# EasyEDA schematic 1-Schematic_8 Bit Computer - Through Hole.json

## Sheets
1 Clock Circuit: TITLE: Clock; REV: 1.0; Date: 2021-02-01; Sheet: 1/1; Drawn By: djh82uk
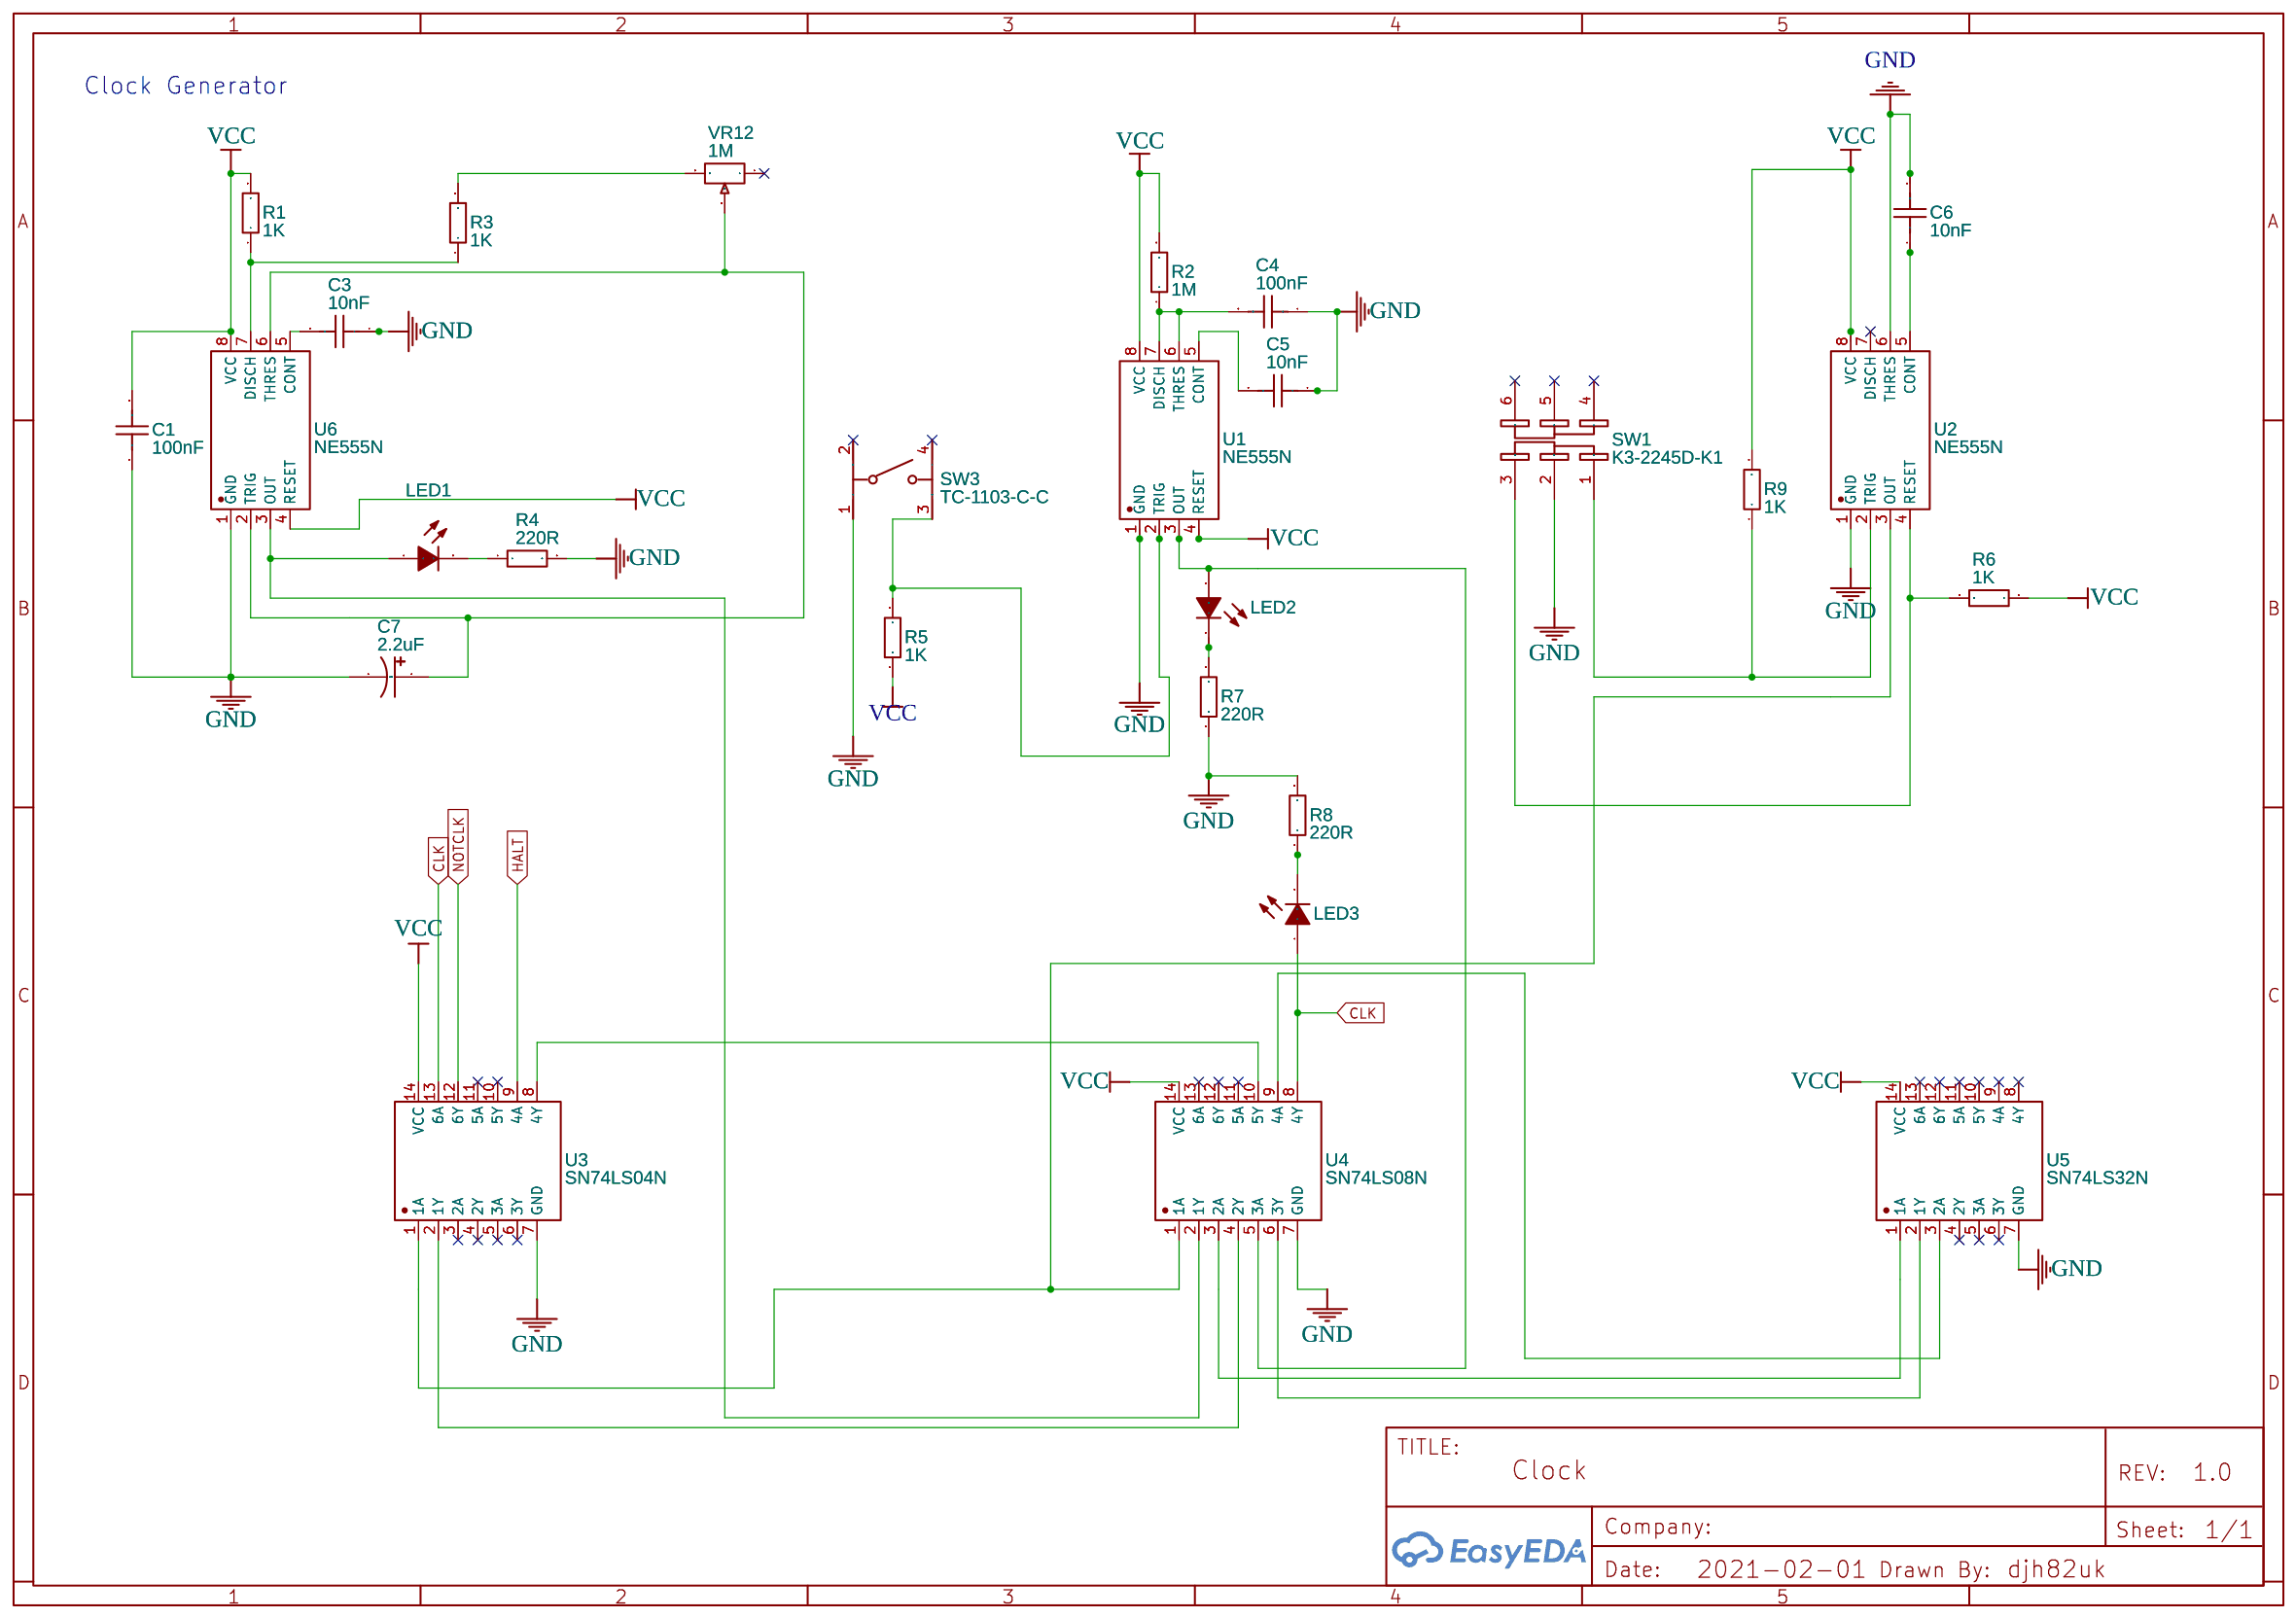
[diagram p0: Clock Circuit]
2 Program Counter: TITLE: Program Counter; Date: 2021-02-04
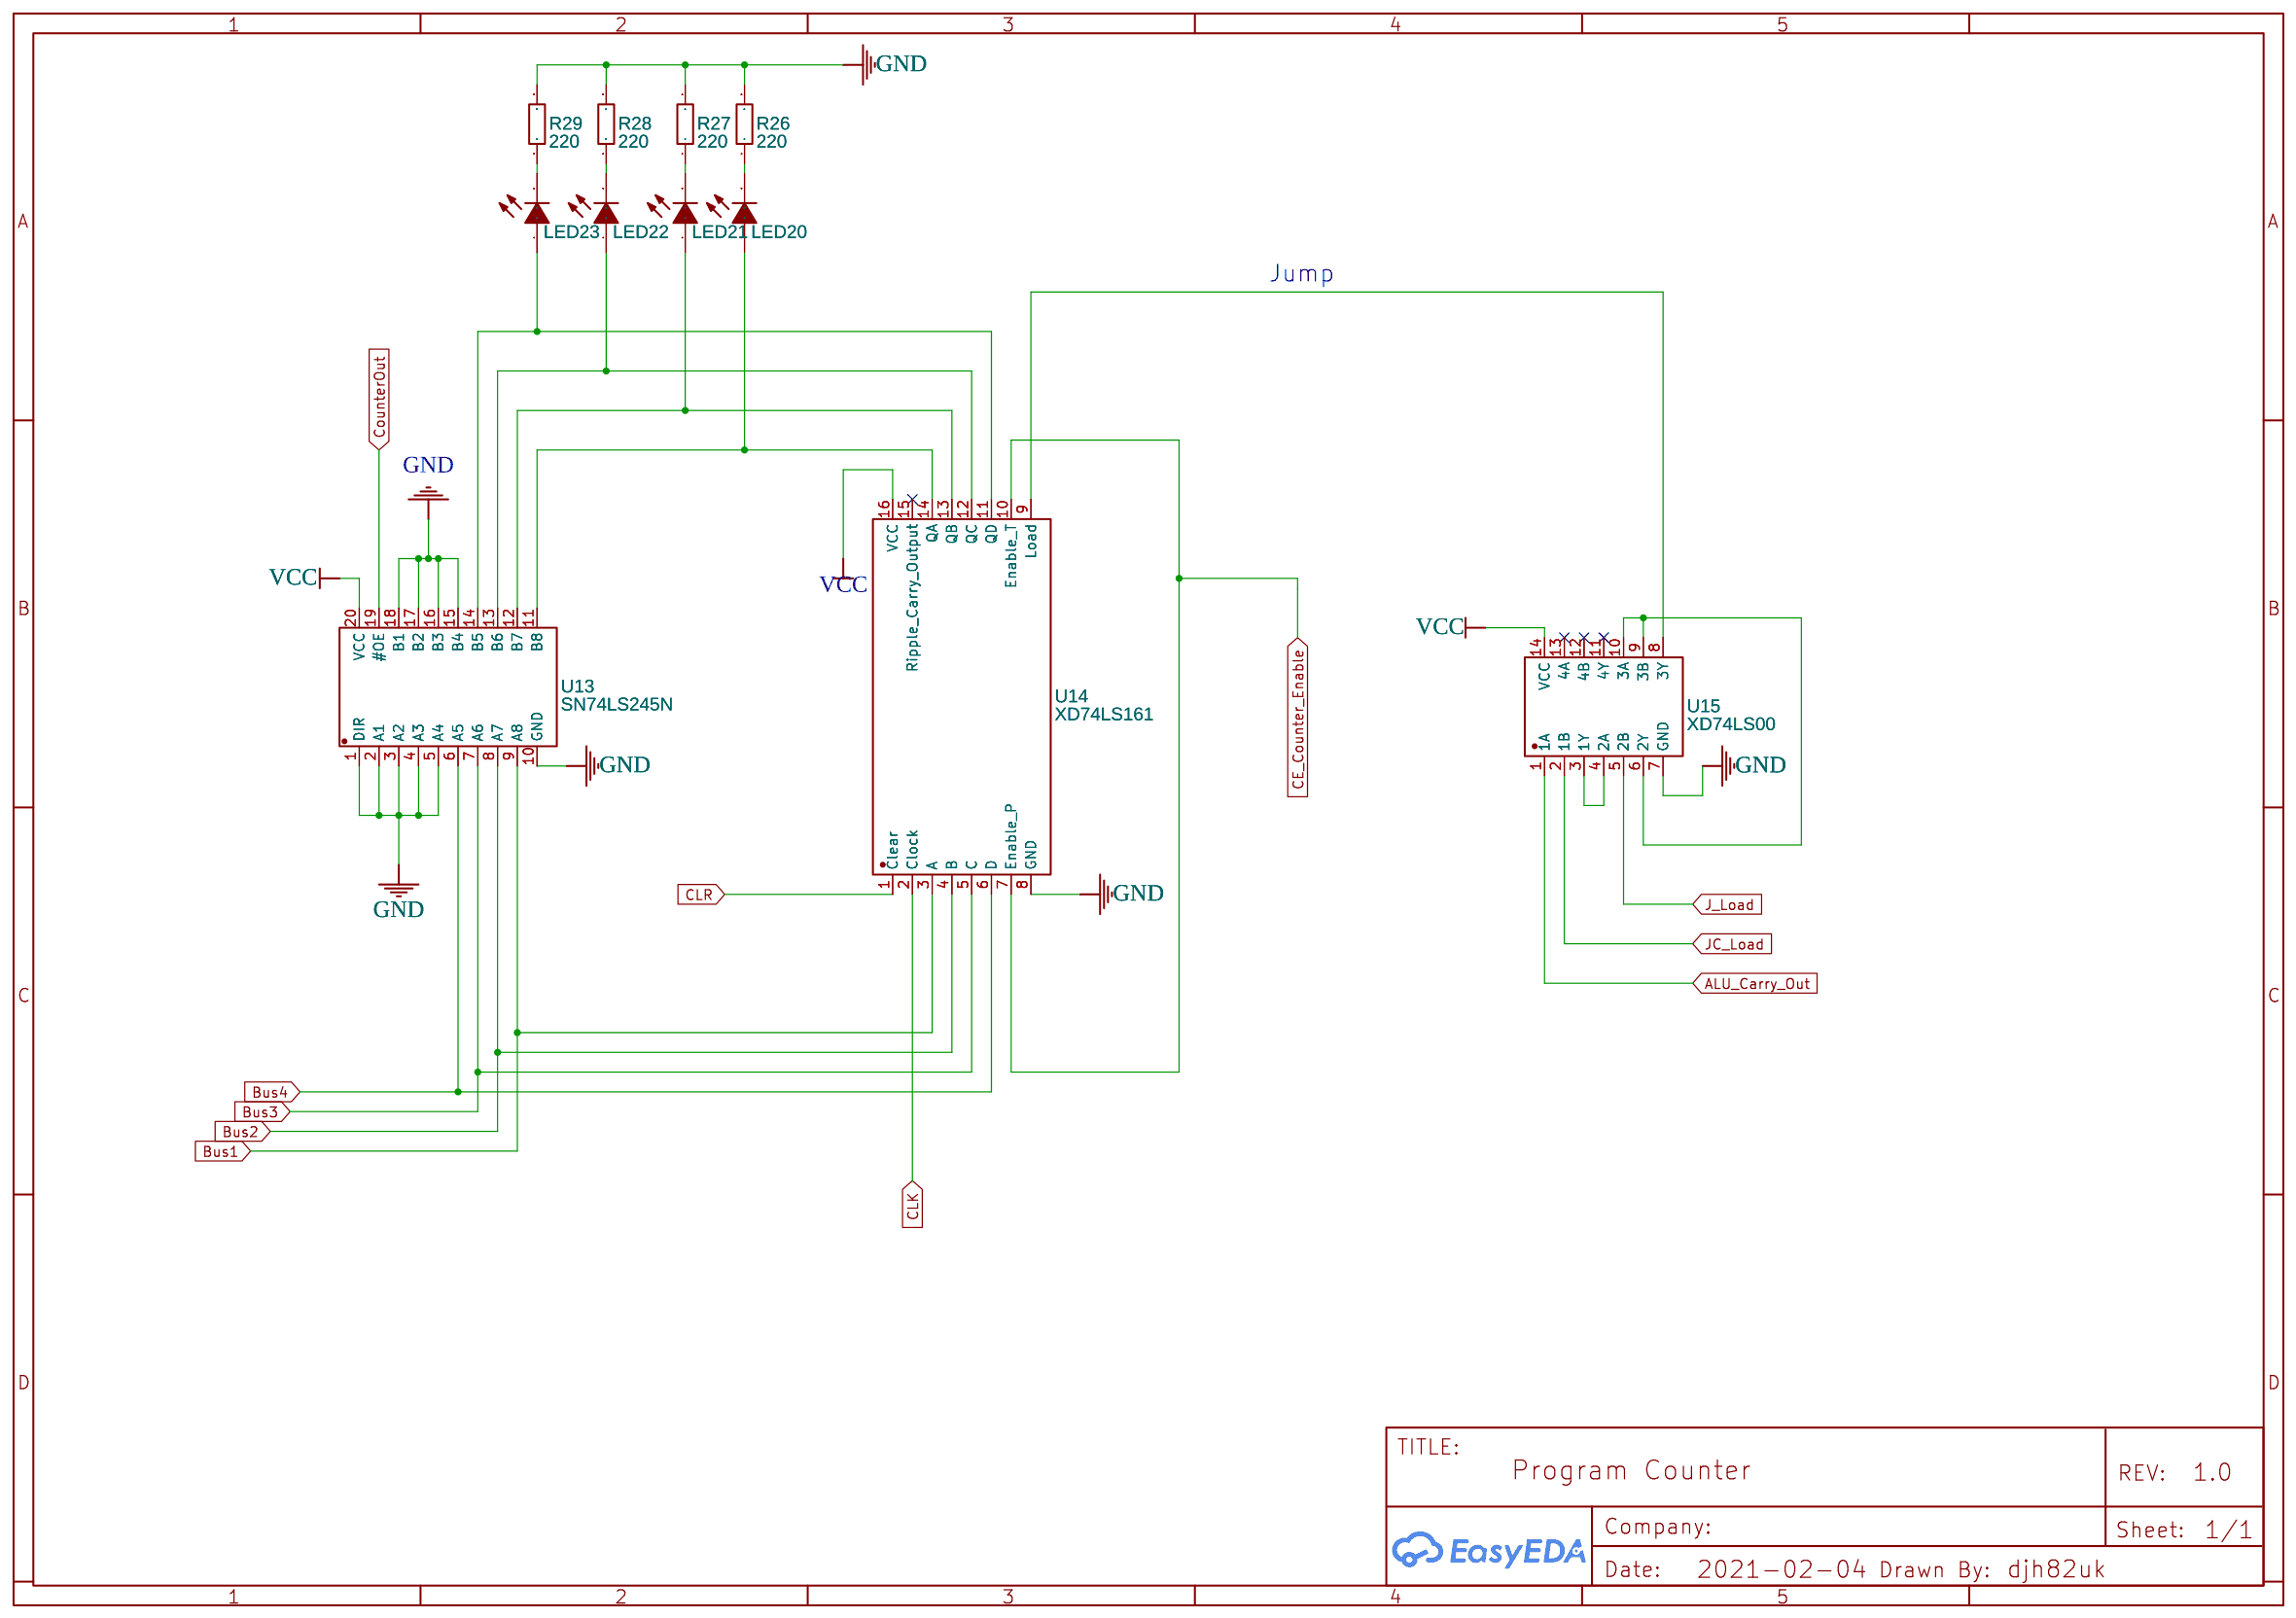
[diagram p1: Program Counter]
3 Register A: TITLE: Register A; Date: 2021-02-05; Company: Your Company
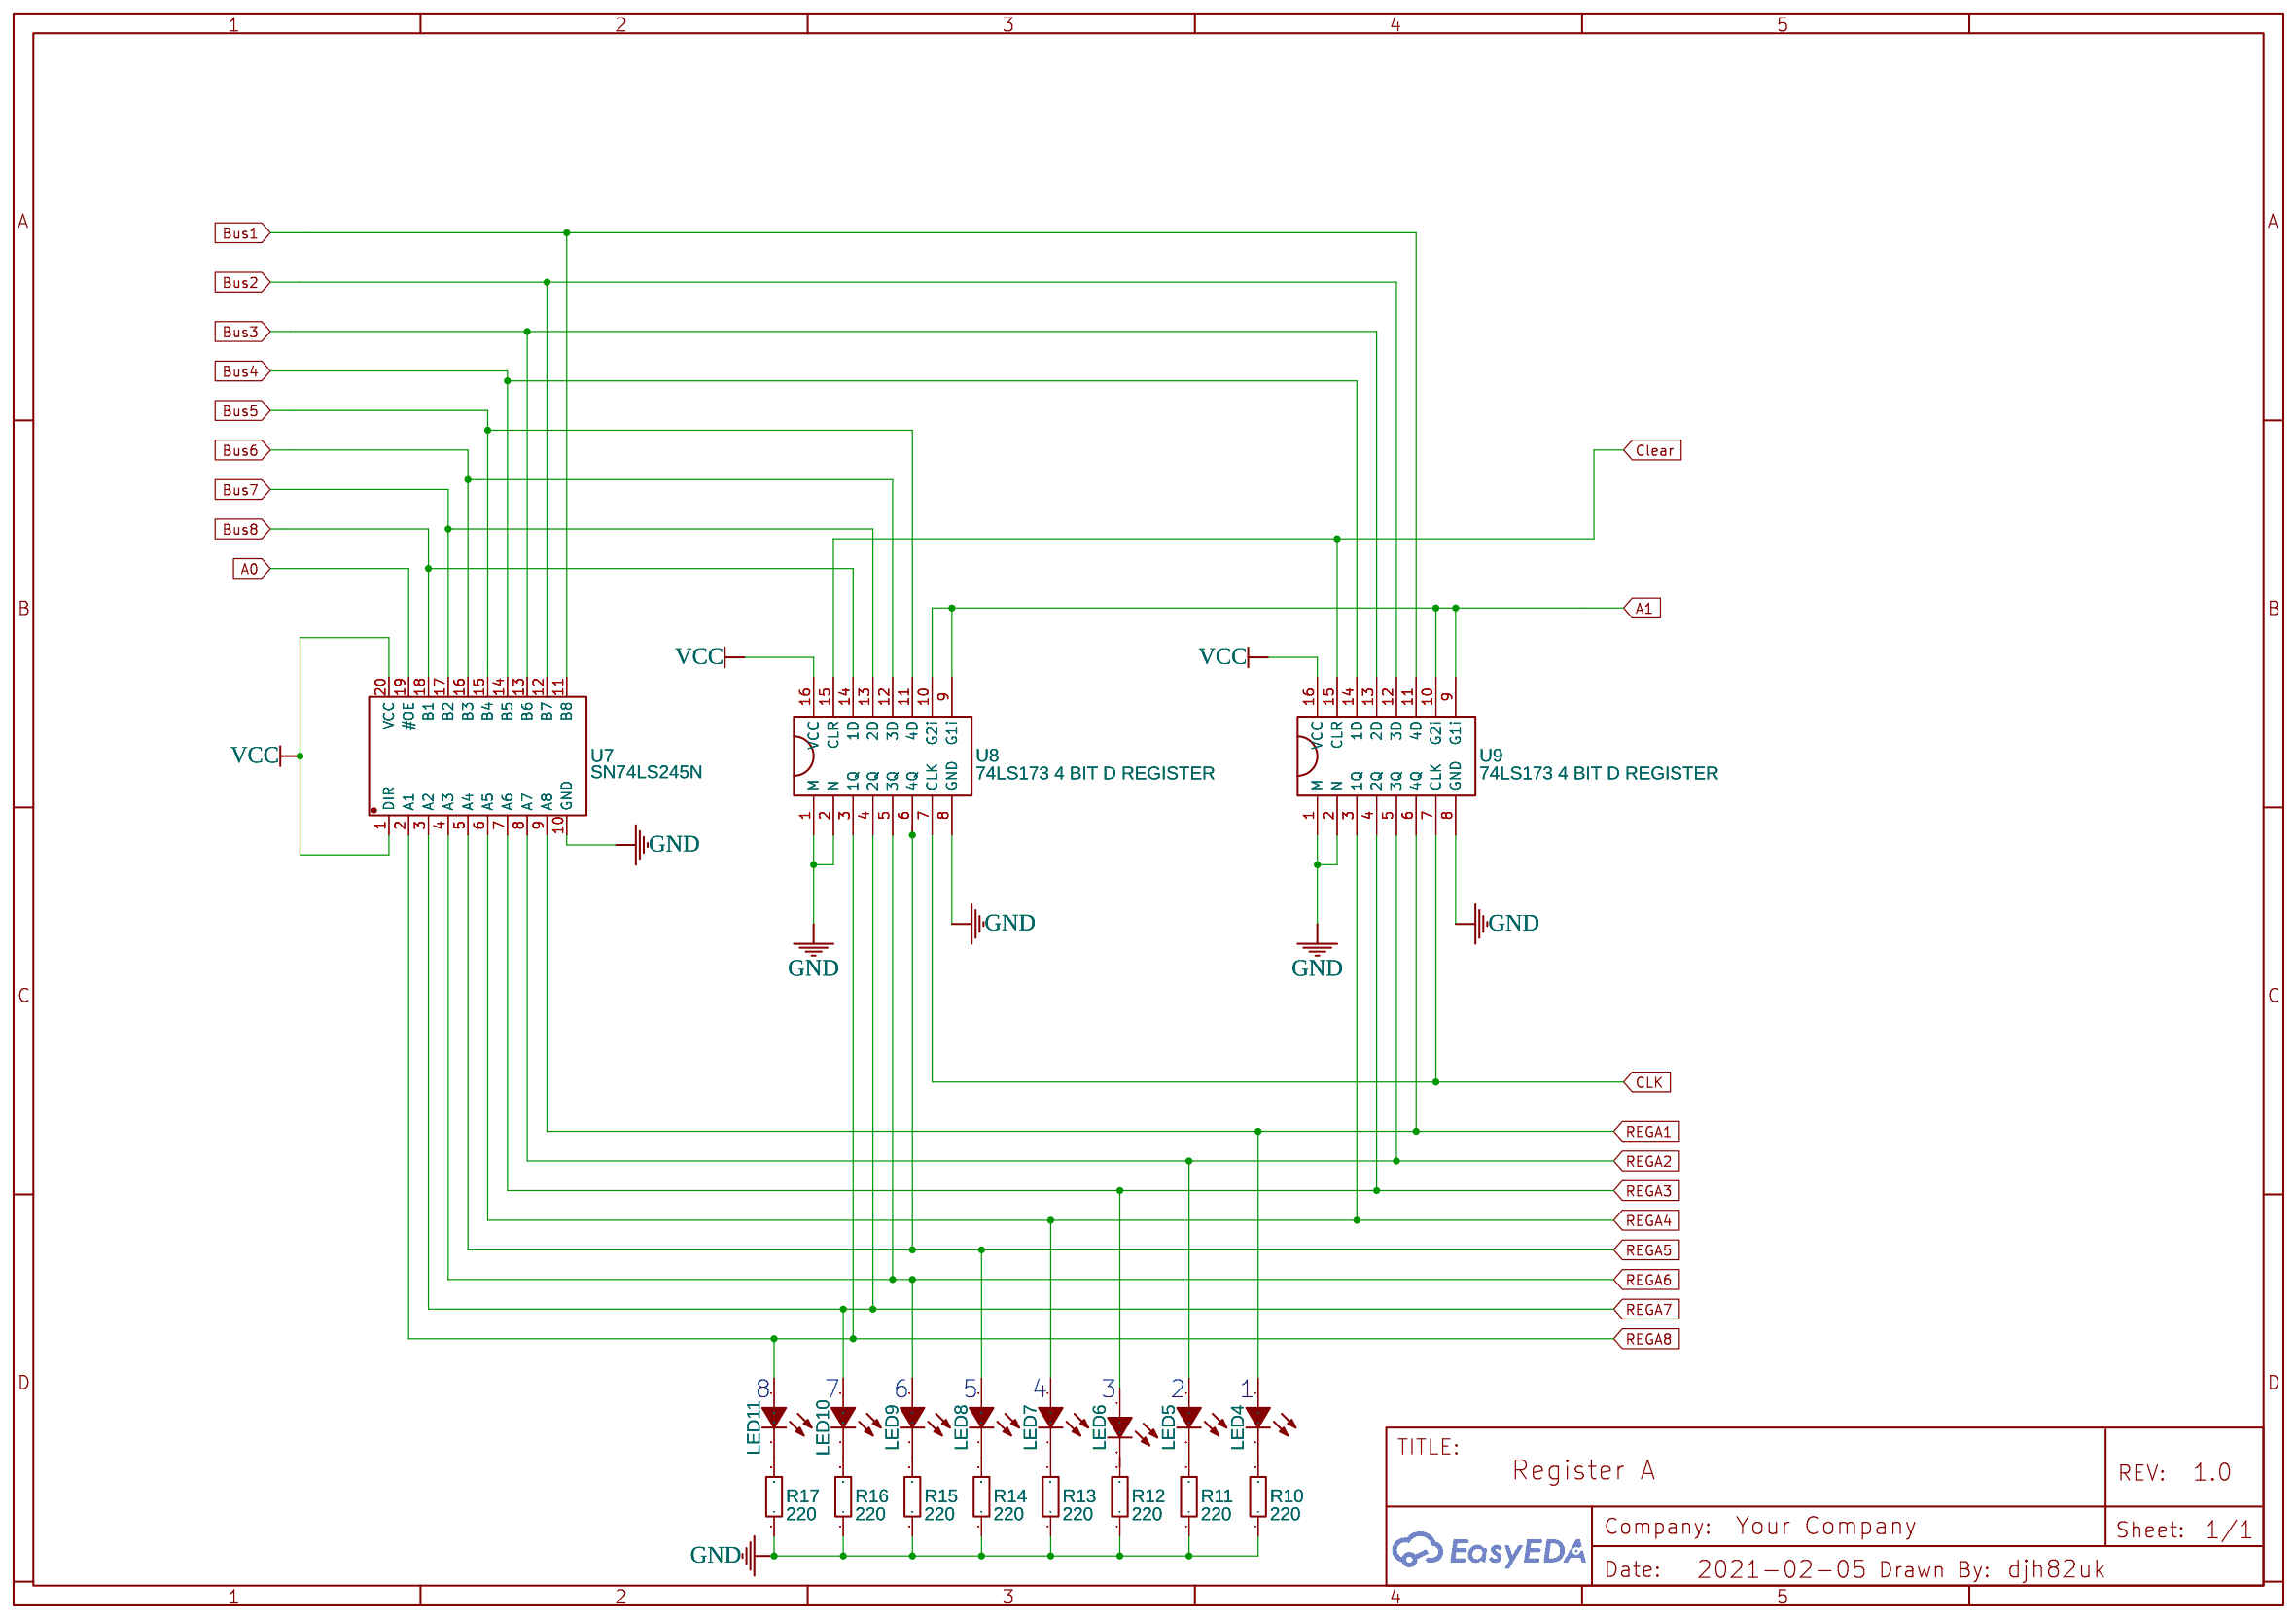
[diagram p2: Register A]
4 Register B: TITLE: Register B; Date: 2021-02-05; Company: Your Company
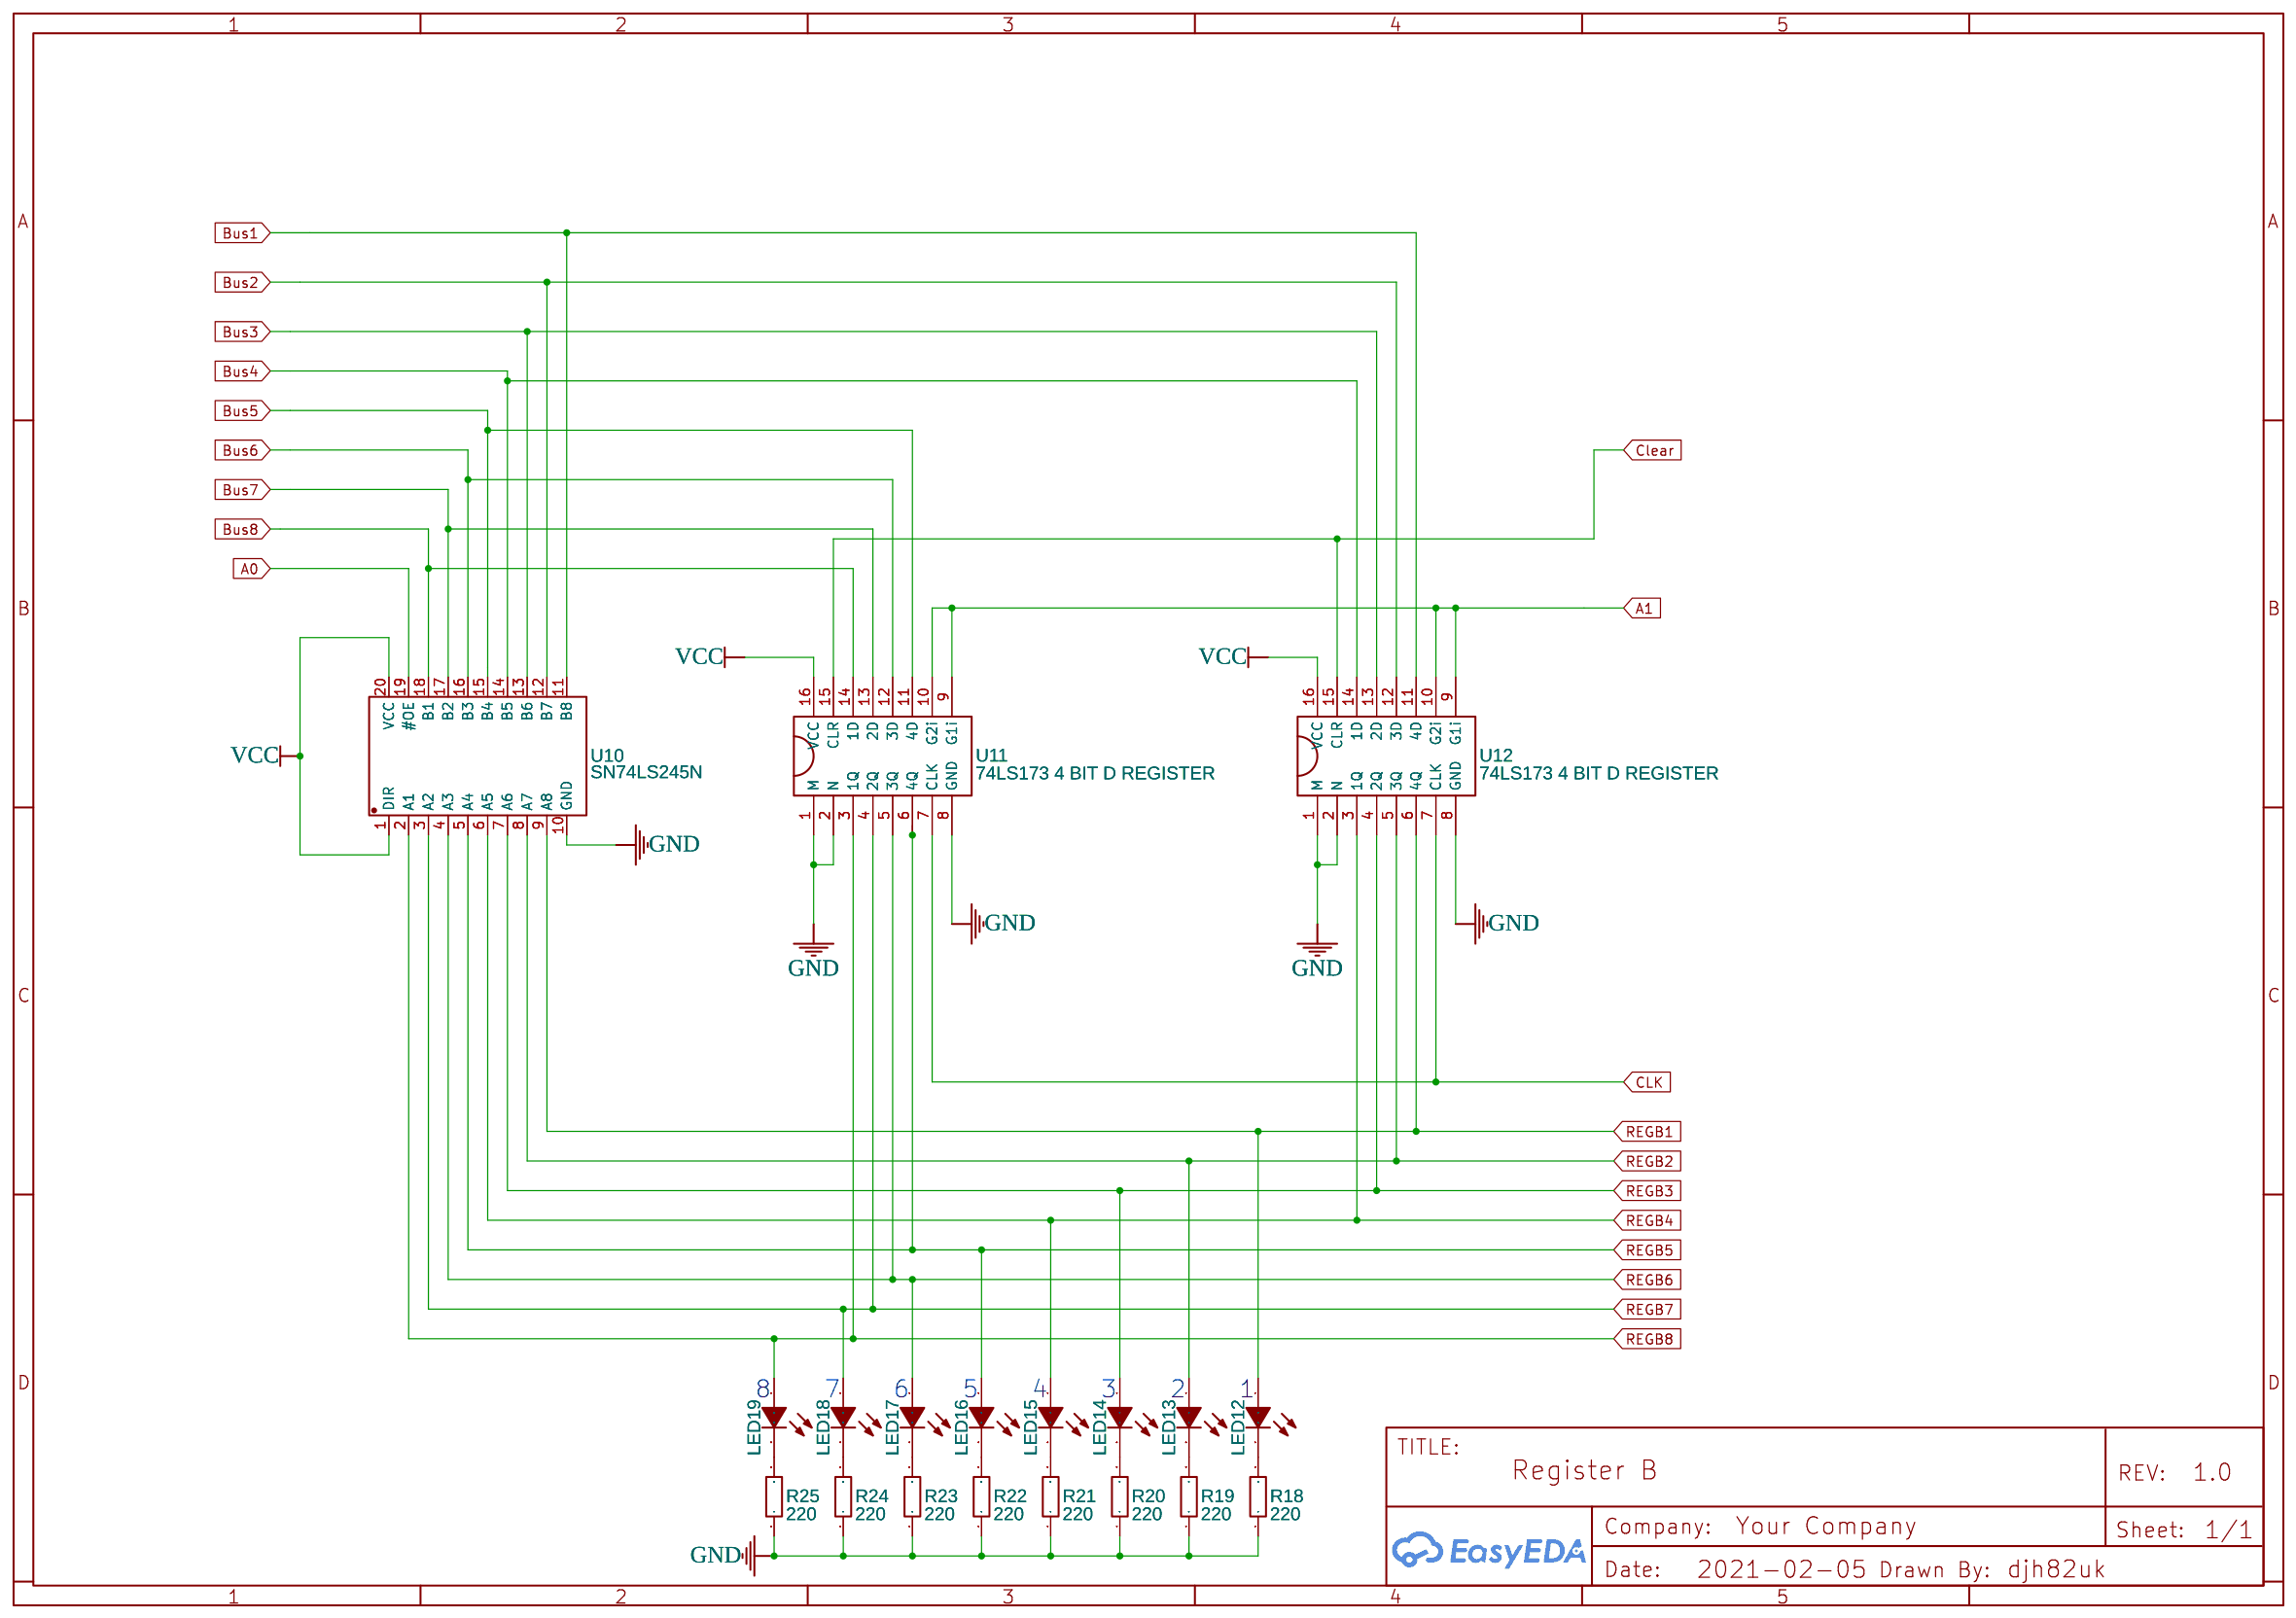
[diagram p3: Register B]
5 Instruction Register: TITLE: Instruction Register; Date: 2021-02-05; Company: Your Company
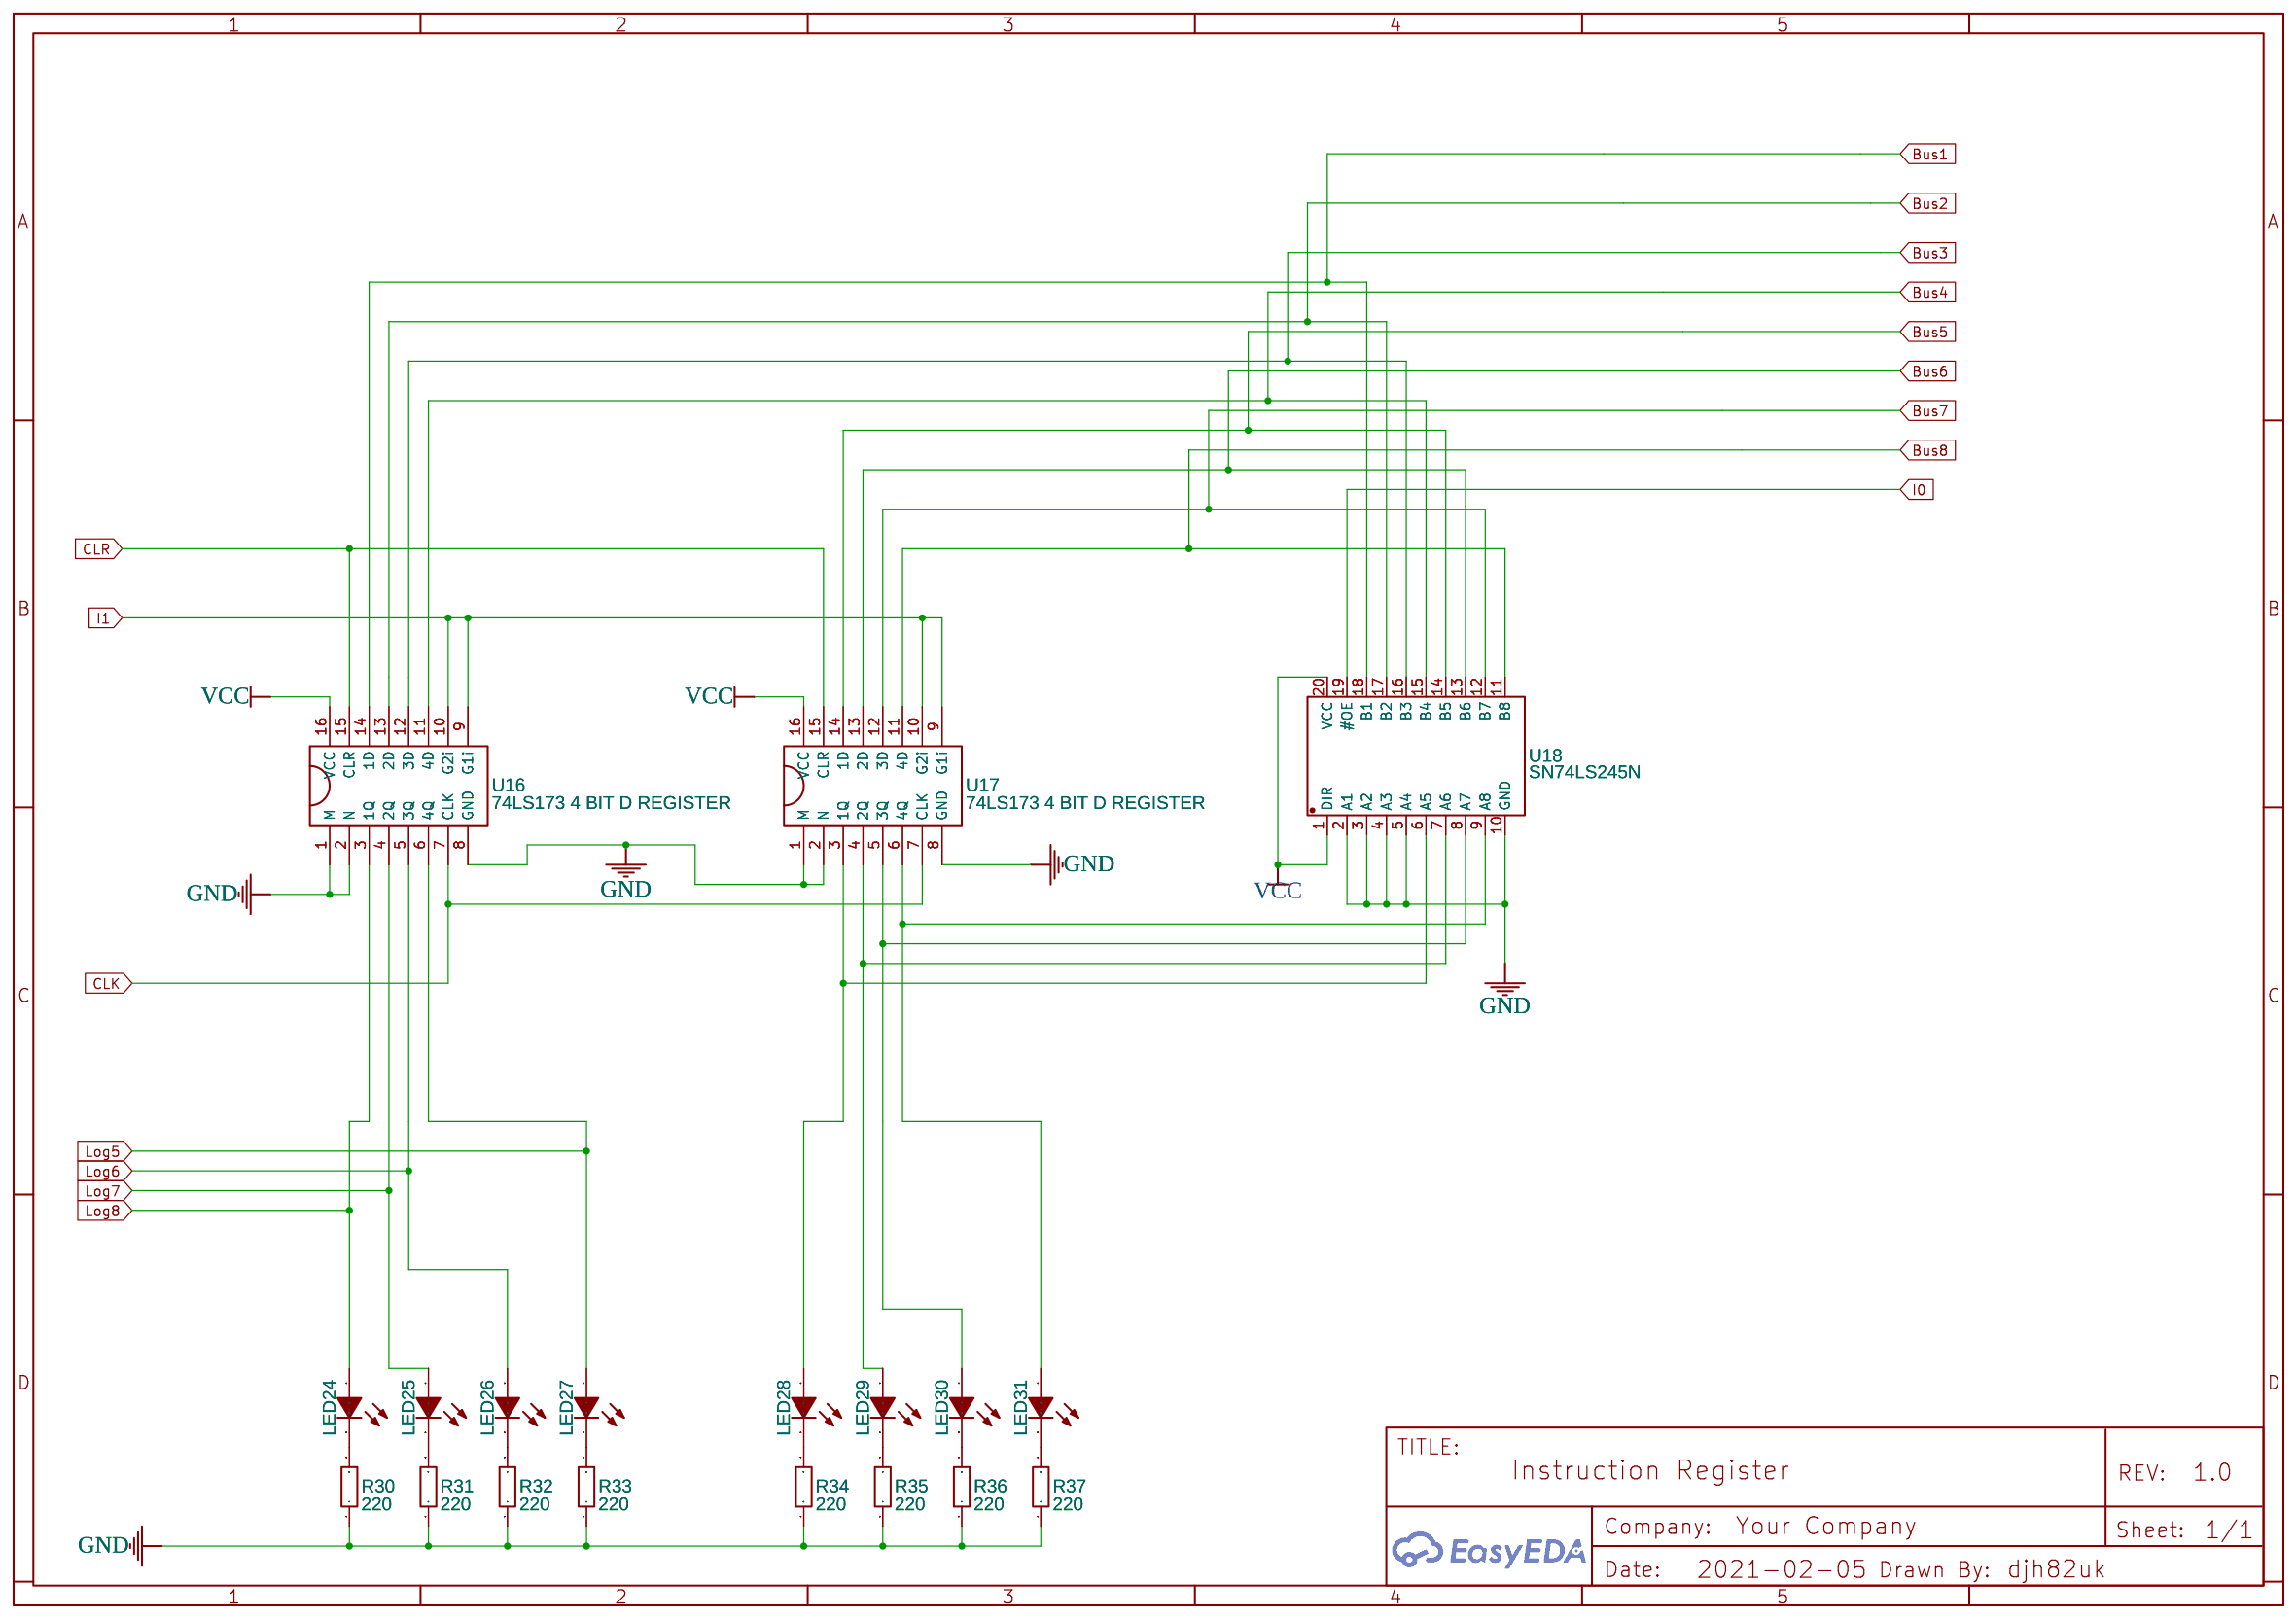
[diagram p4: Instruction Register]
6 ALU: TITLE: ALU; Date: 2021-03-02; Company: Your Company
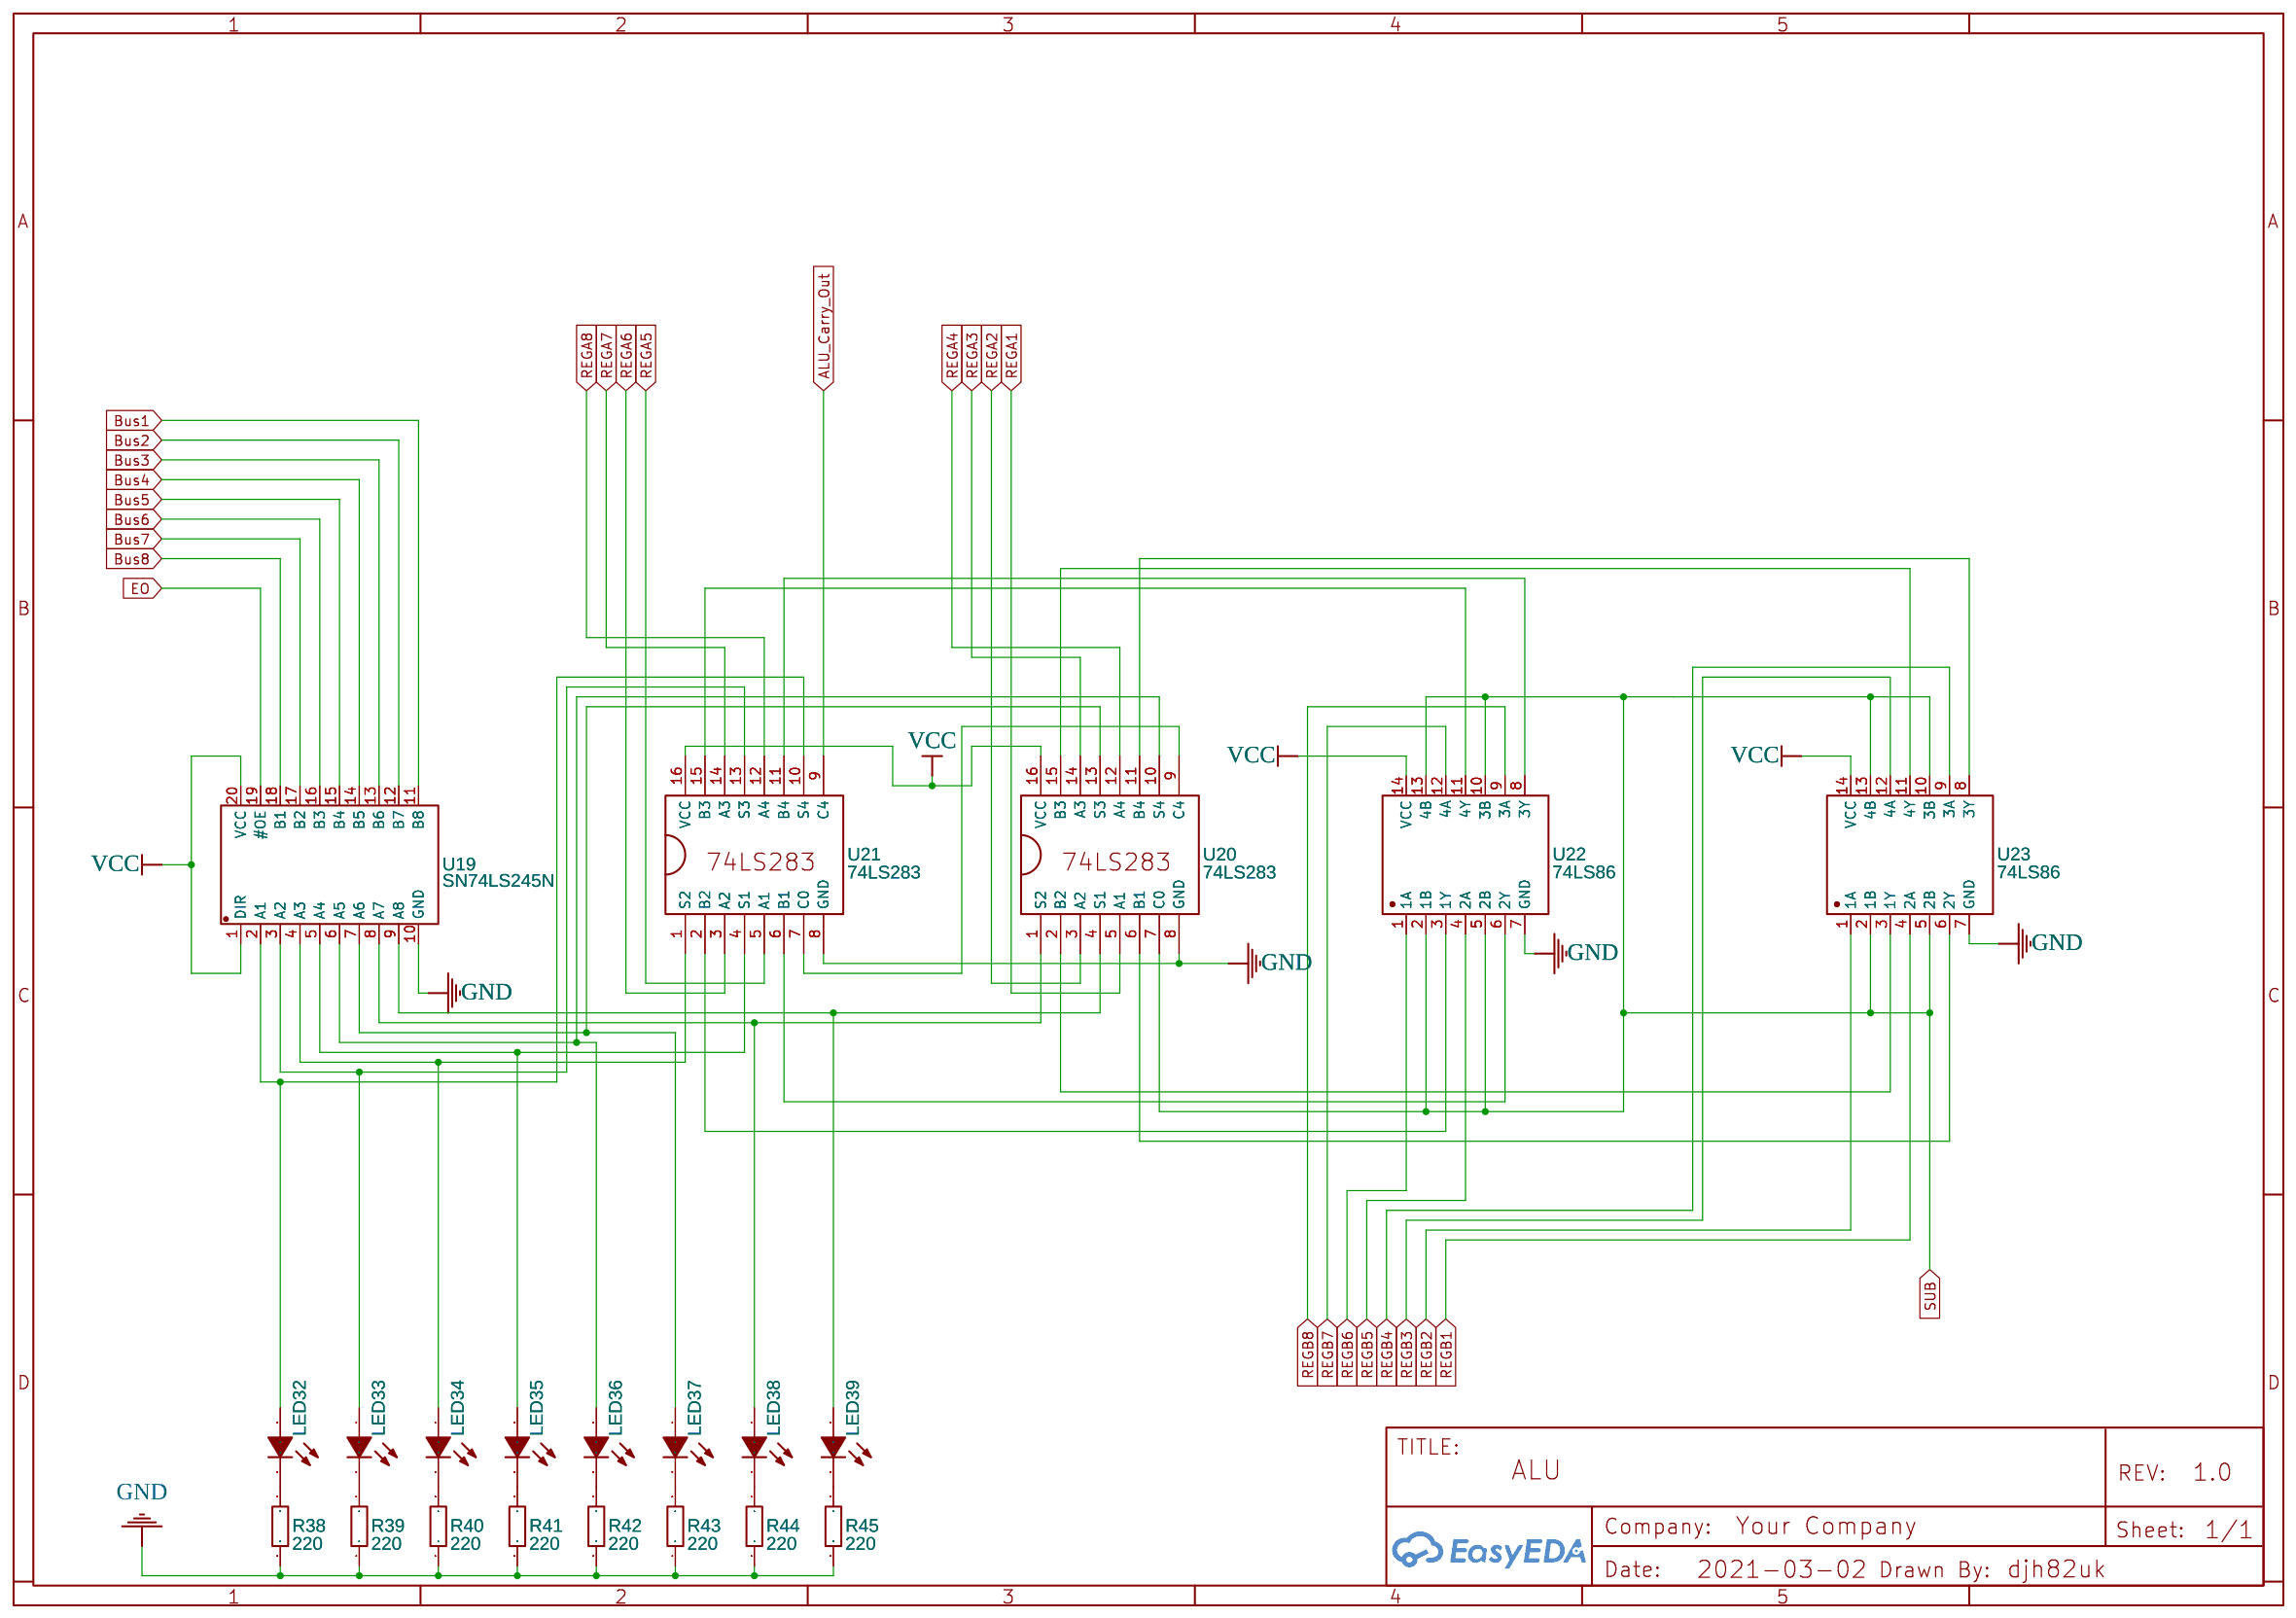
[diagram p5: ALU]
7 BUS: TITLE: BUS; Date: 2021-03-02; Company: Your Company
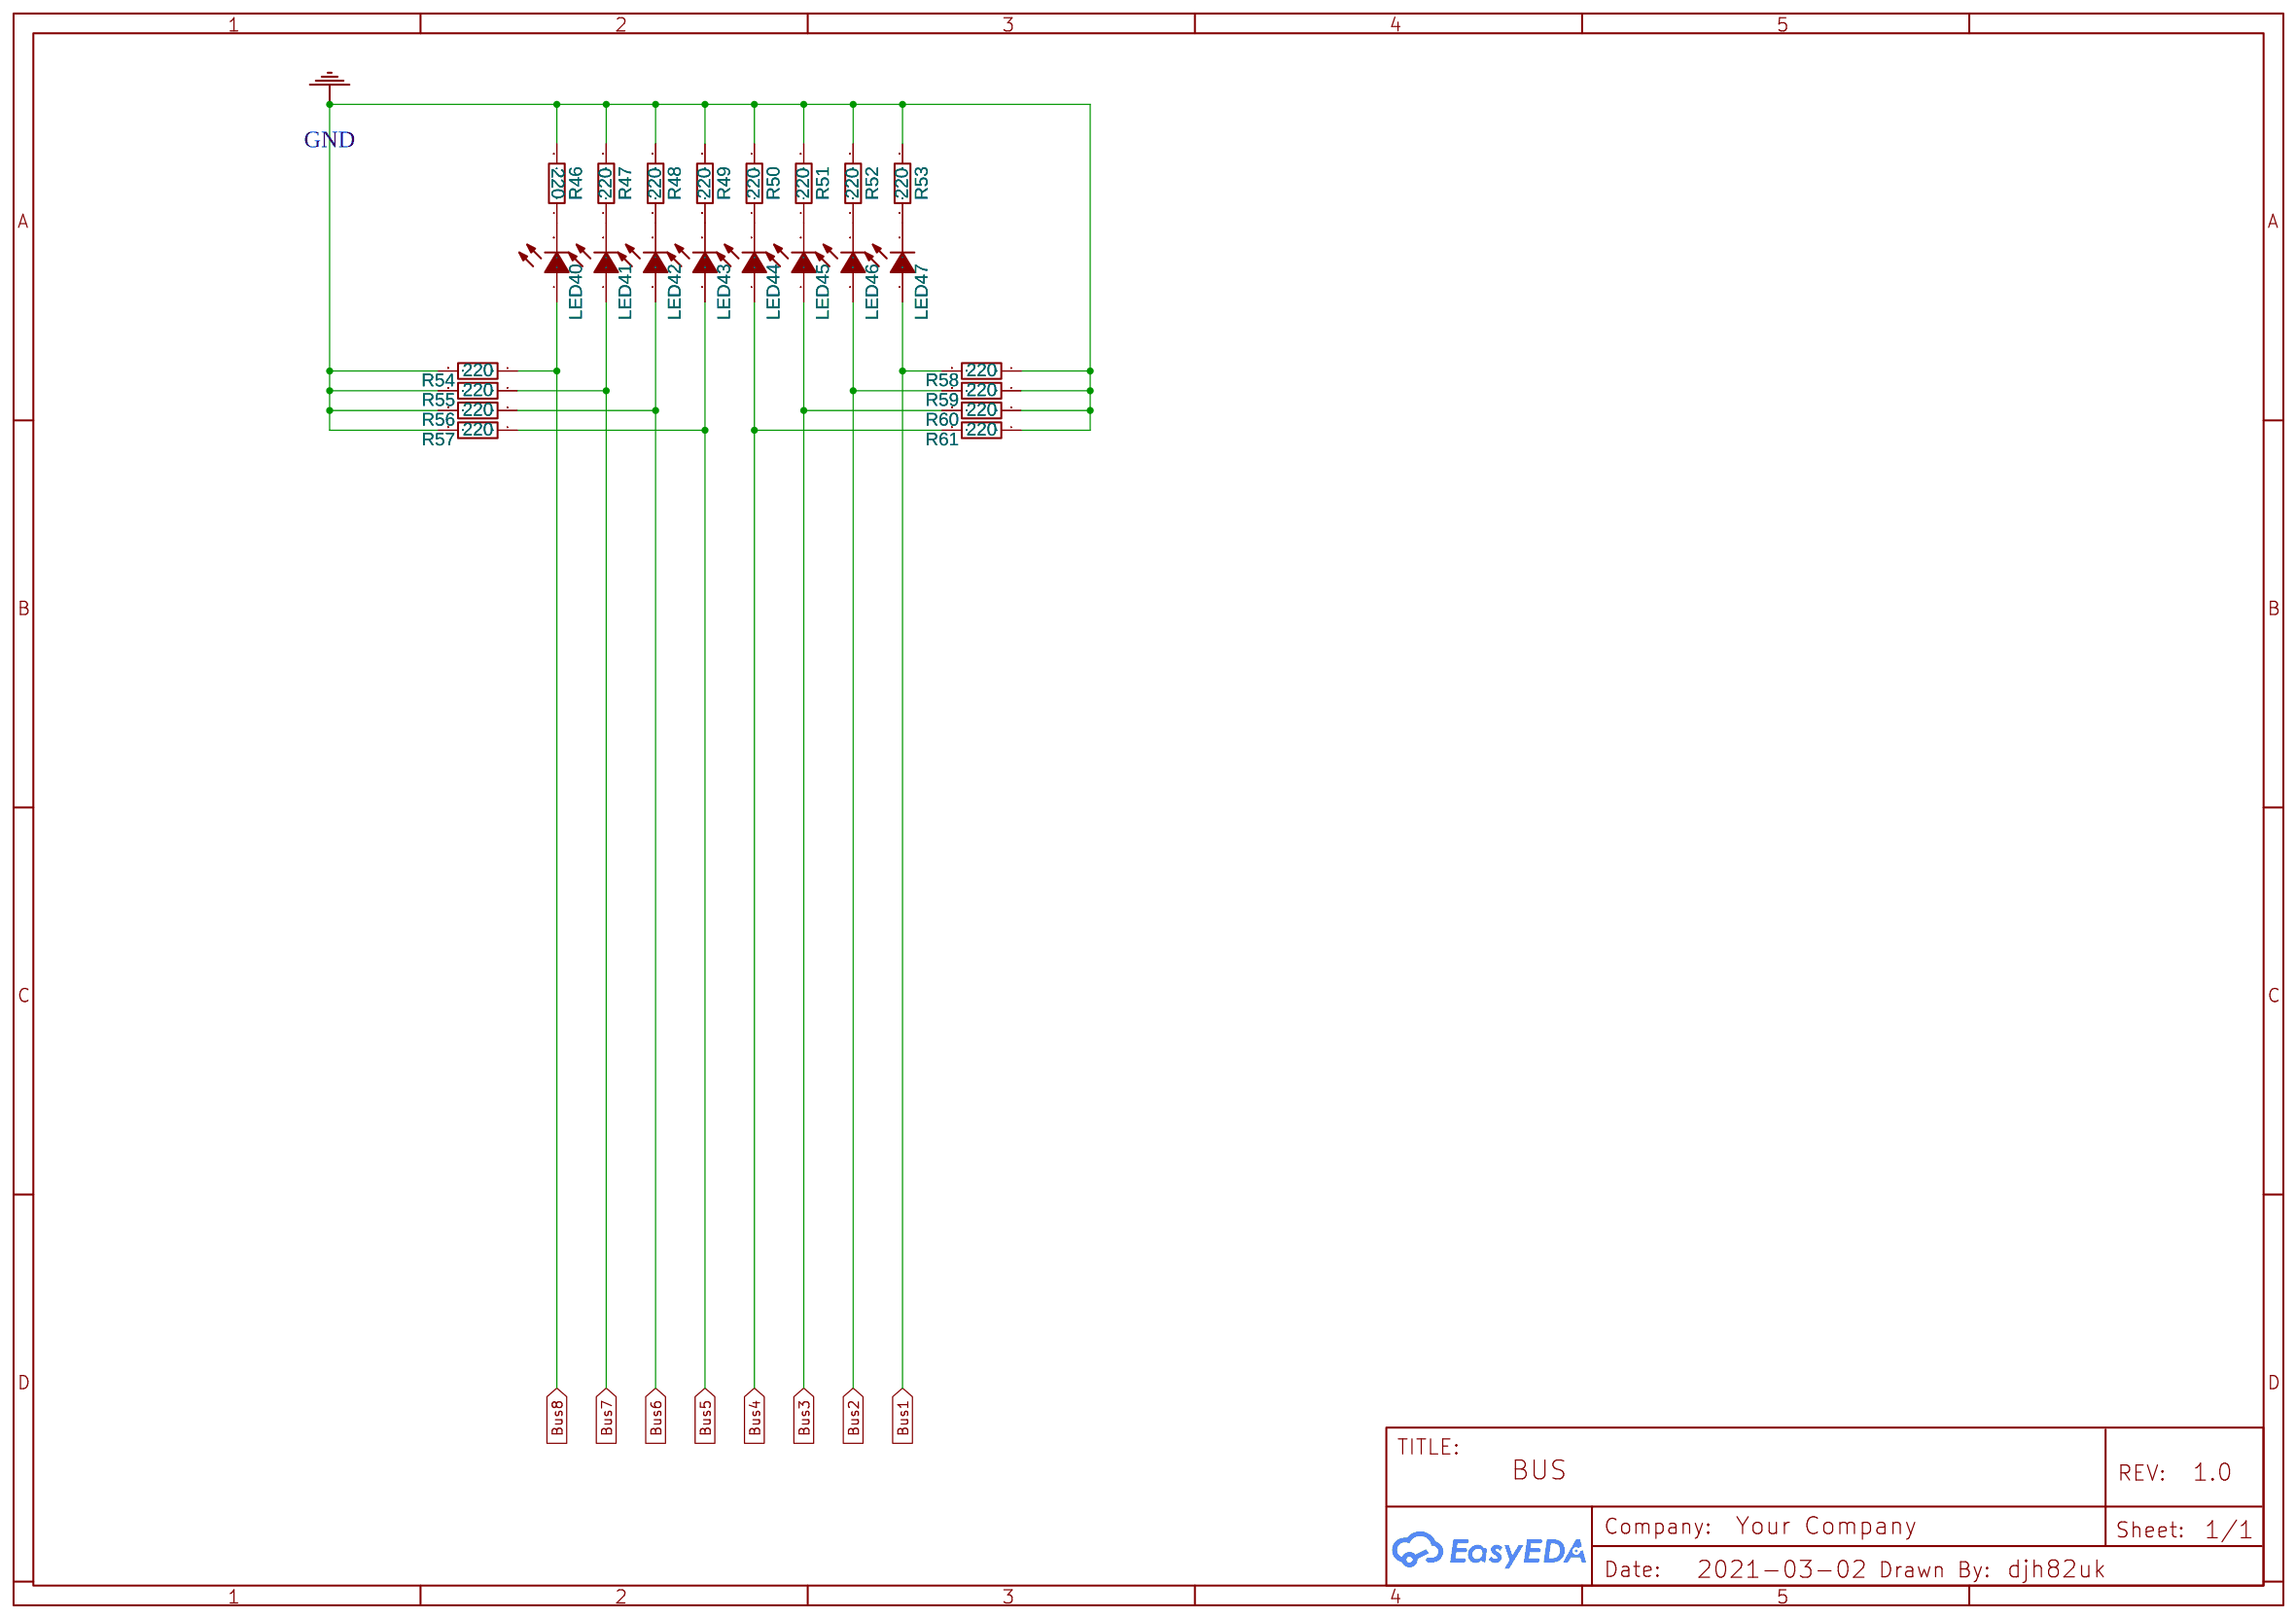
[diagram p6: BUS]

## Parts
sheet ALU
LED32  333-2SYGD/S530-E2-L  [LED-TH_BD5.0-P2.54-FD]
LED33  333-2SYGD/S530-E2-L  [LED-TH_BD5.0-P2.54-FD]
LED34  333-2SYGD/S530-E2-L  [LED-TH_BD5.0-P2.54-FD]
LED35  333-2SYGD/S530-E2-L  [LED-TH_BD5.0-P2.54-FD]
LED36  333-2SYGD/S530-E2-L  [LED-TH_BD5.0-P2.54-FD]
LED37  333-2SYGD/S530-E2-L  [LED-TH_BD5.0-P2.54-FD]
LED38  333-2SYGD/S530-E2-L  [LED-TH_BD5.0-P2.54-FD]
LED39  333-2SYGD/S530-E2-L  [LED-TH_BD5.0-P2.54-FD]
R38  220  [RES-TH_BD1.9-L3.3-P7.30-D0.5]
R39  220  [RES-TH_BD1.9-L3.3-P7.30-D0.5]
R40  220  [RES-TH_BD1.9-L3.3-P7.30-D0.5]
R41  220  [RES-TH_BD1.9-L3.3-P7.30-D0.5]
R42  220  [RES-TH_BD1.9-L3.3-P7.30-D0.5]
R43  220  [RES-TH_BD1.9-L3.3-P7.30-D0.5]
R44  220  [RES-TH_BD1.9-L3.3-P7.30-D0.5]
R45  220  [RES-TH_BD1.9-L3.3-P7.30-D0.5]
U19  SN74LS245N  [DIP-20_L25.5-W10.0-P2.54-LS7.6-BL]
U20  74LS283  [DIP16]
U21  74LS283  [DIP16]
U22  74LS86  [DIP-14_L19.0-W7.0-P2.54-LS7.6-BL]
U23  74LS86  [DIP-14_L19.0-W7.0-P2.54-LS7.6-BL]
sheet BUS
LED40  333-2SYGD/S530-E2-L  [LED-TH_BD5.0-P2.54-FD]
LED41  333-2SYGD/S530-E2-L  [LED-TH_BD5.0-P2.54-FD]
LED42  333-2SYGD/S530-E2-L  [LED-TH_BD5.0-P2.54-FD]
LED43  333-2SYGD/S530-E2-L  [LED-TH_BD5.0-P2.54-FD]
LED44  333-2SYGD/S530-E2-L  [LED-TH_BD5.0-P2.54-FD]
LED45  333-2SYGD/S530-E2-L  [LED-TH_BD5.0-P2.54-FD]
LED46  333-2SYGD/S530-E2-L  [LED-TH_BD5.0-P2.54-FD]
LED47  333-2SYGD/S530-E2-L  [LED-TH_BD5.0-P2.54-FD]
R46  220  [RES-TH_BD1.9-L3.3-P7.30-D0.5]
R47  220  [RES-TH_BD1.9-L3.3-P7.30-D0.5]
R48  220  [RES-TH_BD1.9-L3.3-P7.30-D0.5]
R49  220  [RES-TH_BD1.9-L3.3-P7.30-D0.5]
R50  220  [RES-TH_BD1.9-L3.3-P7.30-D0.5]
R51  220  [RES-TH_BD1.9-L3.3-P7.30-D0.5]
R52  220  [RES-TH_BD1.9-L3.3-P7.30-D0.5]
R53  220  [RES-TH_BD1.9-L3.3-P7.30-D0.5]
R54  220  [RES-TH_BD1.9-L3.3-P7.30-D0.5]
R55  220  [RES-TH_BD1.9-L3.3-P7.30-D0.5]
R56  220  [RES-TH_BD1.9-L3.3-P7.30-D0.5]
R57  220  [RES-TH_BD1.9-L3.3-P7.30-D0.5]
R58  220  [RES-TH_BD1.9-L3.3-P7.30-D0.5]
R59  220  [RES-TH_BD1.9-L3.3-P7.30-D0.5]
R60  220  [RES-TH_BD1.9-L3.3-P7.30-D0.5]
R61  220  [RES-TH_BD1.9-L3.3-P7.30-D0.5]
sheet Clock Circuit
C1  100nF  [CAP-TH_L5.0-W2.5-P5.08-D0.7]
C3  10nF  [CAP-TH_L5.0-W2.5-P5.08-D0.7]
C4  100nF  [CAP-TH_L5.0-W2.5-P5.08-D0.7]
C5  10nF  [CAP-TH_L5.0-W2.5-P5.08-D0.7]
C6  10nF  [CAP-TH_L5.0-W2.5-P5.08-D0.7]
C7  2.2uF  [CAP-TH_BD5.0-P2.00-D0.8-FD]
LED1  333-2SYGD/S530-E2-L  [LED-TH_BD5.0-P2.54-FD]
LED2  333-2SYGD/S530-E2-L  [LED-TH_BD5.0-P2.54-FD]
LED3  333-2SYGD/S530-E2-L  [LED-TH_BD5.0-P2.54-FD]
R1  1K  [RES-TH_BD2.5-L6.5-P10.50-D0.6]
R2  1M  [RES-TH_BD2.5-L6.5-P10.50-D0.6]
R3  1K  [RES-TH_BD2.5-L6.5-P10.50-D0.6]
R4  220R  [RES-TH_BD2.5-L6.5-P10.50-D0.6]
R5  1K  [RES-TH_BD2.5-L6.5-P10.50-D0.6]
R6  1K  [RES-TH_BD2.5-L6.5-P10.50-D0.6]
R7  220R  [RES-TH_BD2.5-L6.5-P10.50-D0.6]
R8  220R  [RES-TH_BD2.5-L6.5-P10.50-D0.6]
R9  1K  [RES-TH_BD2.5-L6.5-P10.50-D0.6]
SW1  K3-2245D-K1  [SW-TH_K3-2245D-L1]
SW3  TC-1103-C-C  [KEY-TH_4P-L12.0-W12.0-P5.00-LS12.5-BL]
U1  NE555N  [DIP-8_L9.8-W6.6-P2.54-LS7.6-BL]
U2  NE555N  [DIP-8_L9.8-W6.6-P2.54-LS7.6-BL]
U3  SN74LS04N  [PDIP-14_L19.7-W6.6-P2.54-LS8.3-BL]
U4  SN74LS08N  [PDIP-14_L19.7-W6.6-P2.54-LS8.3-BL]
U5  SN74LS32N  [PDIP-14_L19.7-W6.6-P2.54-LS8.3-BL]
U6  NE555N  [DIP-8_L9.8-W6.6-P2.54-LS7.6-BL]
VR12  1M  [RES-ADJ-TH_3P-L9.5-W4.9-P2.50-L_3296W]
sheet Instruction Register
LED24  333-2SYGD/S530-E2-L  [LED-TH_BD5.0-P2.54-FD]
LED25  333-2SYGD/S530-E2-L  [LED-TH_BD5.0-P2.54-FD]
LED26  333-2SYGD/S530-E2-L  [LED-TH_BD5.0-P2.54-FD]
LED27  333-2SYGD/S530-E2-L  [LED-TH_BD5.0-P2.54-FD]
LED28  333-2SYGD/S530-E2-L  [LED-TH_BD5.0-P2.54-FD]
LED29  333-2SYGD/S530-E2-L  [LED-TH_BD5.0-P2.54-FD]
LED30  333-2SYGD/S530-E2-L  [LED-TH_BD5.0-P2.54-FD]
LED31  333-2SYGD/S530-E2-L  [LED-TH_BD5.0-P2.54-FD]
R30  220  [RES-TH_BD1.9-L3.3-P7.30-D0.5]
R31  220  [RES-TH_BD1.9-L3.3-P7.30-D0.5]
R32  220  [RES-TH_BD1.9-L3.3-P7.30-D0.5]
R33  220  [RES-TH_BD1.9-L3.3-P7.30-D0.5]
R34  220  [RES-TH_BD1.9-L3.3-P7.30-D0.5]
R35  220  [RES-TH_BD1.9-L3.3-P7.30-D0.5]
R36  220  [RES-TH_BD1.9-L3.3-P7.30-D0.5]
R37  220  [RES-TH_BD1.9-L3.3-P7.30-D0.5]
U16  74LS173 4 BIT D REGISTER  [16 PIN DIP]
U17  74LS173 4 BIT D REGISTER  [16 PIN DIP]
U18  SN74LS245N  [DIP-20_L25.5-W10.0-P2.54-LS7.6-BL]
sheet Program Counter
LED20  333-2SYGD/S530-E2-L  [LED-TH_BD5.0-P2.54-FD]
LED21  333-2SYGD/S530-E2-L  [LED-TH_BD5.0-P2.54-FD]
LED22  333-2SYGD/S530-E2-L  [LED-TH_BD5.0-P2.54-FD]
LED23  333-2SYGD/S530-E2-L  [LED-TH_BD5.0-P2.54-FD]
R26  220  [RES-TH_BD1.9-L3.3-P7.30-D0.5]
R27  220  [RES-TH_BD1.9-L3.3-P7.30-D0.5]
R28  220  [RES-TH_BD1.9-L3.3-P7.30-D0.5]
R29  220  [RES-TH_BD1.9-L3.3-P7.30-D0.5]
U13  SN74LS245N  [DIP-20_L25.5-W10.0-P2.54-LS7.6-BL]
U14  XD74LS161  [DIP-16_L19.2-W6.6-P2.54-LS7.6-BL]
U15  XD74LS00  [DIP-14_L20.0-W7.6-P2.54-LS7.6-BL]
sheet Register A
LED4  333-2SYGD/S530-E2-L  [LED-TH_BD5.0-P2.54-FD]
LED5  333-2SYGD/S530-E2-L  [LED-TH_BD5.0-P2.54-FD]
LED6  333-2SYGD/S530-E2-L  [LED-TH_BD5.0-P2.54-FD]
LED7  333-2SYGD/S530-E2-L  [LED-TH_BD5.0-P2.54-FD]
LED8  333-2SYGD/S530-E2-L  [LED-TH_BD5.0-P2.54-FD]
LED9  333-2SYGD/S530-E2-L  [LED-TH_BD5.0-P2.54-FD]
LED10  333-2SYGD/S530-E2-L  [LED-TH_BD5.0-P2.54-FD]
LED11  333-2SYGD/S530-E2-L  [LED-TH_BD5.0-P2.54-FD]
R10  220  [RES-TH_BD1.9-L3.3-P7.30-D0.5]
R11  220  [RES-TH_BD1.9-L3.3-P7.30-D0.5]
R12  220  [RES-TH_BD1.9-L3.3-P7.30-D0.5]
R13  220  [RES-TH_BD1.9-L3.3-P7.30-D0.5]
R14  220  [RES-TH_BD1.9-L3.3-P7.30-D0.5]
R15  220  [RES-TH_BD1.9-L3.3-P7.30-D0.5]
R16  220  [RES-TH_BD1.9-L3.3-P7.30-D0.5]
R17  220  [RES-TH_BD1.9-L3.3-P7.30-D0.5]
U7  SN74LS245N  [DIP-20_L25.5-W10.0-P2.54-LS7.6-BL]
U8  74LS173 4 BIT D REGISTER  [16 PIN DIP]
U9  74LS173 4 BIT D REGISTER  [16 PIN DIP]
sheet Register B
LED12  333-2SYGD/S530-E2-L  [LED-TH_BD5.0-P2.54-FD]
LED13  333-2SYGD/S530-E2-L  [LED-TH_BD5.0-P2.54-FD]
LED14  333-2SYGD/S530-E2-L  [LED-TH_BD5.0-P2.54-FD]
LED15  333-2SYGD/S530-E2-L  [LED-TH_BD5.0-P2.54-FD]
LED16  333-2SYGD/S530-E2-L  [LED-TH_BD5.0-P2.54-FD]
LED17  333-2SYGD/S530-E2-L  [LED-TH_BD5.0-P2.54-FD]
LED18  333-2SYGD/S530-E2-L  [LED-TH_BD5.0-P2.54-FD]
LED19  333-2SYGD/S530-E2-L  [LED-TH_BD5.0-P2.54-FD]
R18  220  [RES-TH_BD1.9-L3.3-P7.30-D0.5]
R19  220  [RES-TH_BD1.9-L3.3-P7.30-D0.5]
R20  220  [RES-TH_BD1.9-L3.3-P7.30-D0.5]
R21  220  [RES-TH_BD1.9-L3.3-P7.30-D0.5]
R22  220  [RES-TH_BD1.9-L3.3-P7.30-D0.5]
R23  220  [RES-TH_BD1.9-L3.3-P7.30-D0.5]
R24  220  [RES-TH_BD1.9-L3.3-P7.30-D0.5]
R25  220  [RES-TH_BD1.9-L3.3-P7.30-D0.5]
U10  SN74LS245N  [DIP-20_L25.5-W10.0-P2.54-LS7.6-BL]
U11  74LS173 4 BIT D REGISTER  [16 PIN DIP]
U12  74LS173 4 BIT D REGISTER  [16 PIN DIP]

## Library data of the parts
LED1-LED47 = 333-2SYGD/S530-E2-L: Supplier: LCSC; Manufacturer: EVERLIGHT; Supplier Part: C99697; LCSC Assembly: Yes; SMT Type: Extend
R10-R61 = MFR0W8F2200A50: Supplier: LCSC; Supplier Part: C63394; Manufacturer: Uniroyal Elec; Contributor: LCSC; LCSC Assembly: Yes; SMT Type: Extend
U7 U10 U13 U18 U19 = SN74LS245N: Supplier: LCSC; Supplier Part: C352966; Manufacturer: Texas Instruments; Contributor: LCSC; LCSC Assembly: Yes; SMT Type: Extend
U20 U21 = 74LS283: Contributor: halldorst1; Supplier: LCSC
U22 U23 = 74LS86: Supplier: LCSC; Manufacturer: HIT; Supplier Part: C21802
C1 C3-C6 = CC1H103ZC4PD3F4D30MF: Supplier: LCSC; Supplier Part: C254066; Manufacturer: Dersonic; Contributor: LCSC; LCSC Assembly: Yes; SMT Type: Extend
C7 = RGA2R2M1HSA-0511G: Supplier: LCSC; Supplier Part: C358629; Manufacturer: Lelon; Contributor: LCSC; LCSC Assembly: Yes; SMT Type: Extend
R1-R9 = MFR0W4F1003A50: Supplier: LCSC; Manufacturer: UniOhm; Supplier Part: C58597; LCSC Assembly: Yes; SMT Type: Extend
SW1 = K3-2245D-K1: Supplier: LCSC; Supplier Part: C223864; Manufacturer: Korean Hroparts Elec; Contributor: LCSC; LCSC Assembly: Yes; SMT Type: Extend
SW3 = TC-1103-C-C: Supplier: LCSC; Supplier Part: C318976; Manufacturer: XKB Enterprise; Contributor: LCSC; LCSC Assembly: Yes; SMT Type: Extend
U1 U2 U6 = NE555N: Supplier: LCSC; Supplier Part: C398063; Manufacturer: HGSEMI; Contributor: LCSC
U3-U5 = SN74LS04N: Supplier: LCSC; Supplier Part: C183657; Manufacturer: Texas Instruments; Contributor: LCSC
VR12 = 3296W-1-104: Supplier: LCSC; Supplier Part: C118963; Manufacturer: Chengdu Guosheng Tech; Resistance(Ohms): 100K; Contributor: LCSC; LCSC Assembly: Yes; SMT Type: Extend
U8 U9 U11 U12 U16 U17 = 74LS173 4 BIT D REGISTER: Contributor: Mike Orr
U14 = XD74LS161: Supplier: LCSC; Supplier Part: C609766; Manufacturer: XINLUDA; Contributor: LCSC
U15 = XD74LS00: Supplier: LCSC; Supplier Part: C556265; Manufacturer: XINLUDA; Contributor: LCSC

## Nets
GND: C1.1 C3.1 C4.1 C5.1 C6.2 C7.2 R4.2 R7.1 R8.2 R10.1 R11.1 R12.1 R13.1 R14.1 R15.1 R16.1 R17.1 R18.1 R19.1 R20.1 R21.1 R22.1 R23.1 R24.1 R25.1 R26.2 R27.2 R28.2 R29.2 R30.1 R31.1 R32.1 R33.1 R34.1 R35.1 R36.1 R37.1 R38.1 R39.1 R40.1 R41.1 R42.1 R43.1 R44.1 R45.1 R46.2 R47.2 R48.2 R49.2 R50.2 R51.2 R52.2 R53.2 R54.2 R55.2 R56.2 R57.2 R58.1 R59.1 R60.1 R61.1 SW1.2 SW3.1 U1.1(GND) U2.1(GND) U2.6(THRES) U3.7(GND) U4.7(GND) U5.7(GND) U6.1(GND) U7.10(GND) U8.1(M) U8.2(N) U8.8(GND) U9.1(M) U9.2(N) U9.8(GND) U10.10(GND) U11.1(M) U11.2(N) U11.8(GND) U12.1(M) U12.2(N) U12.8(GND) U13.1(DIR) U13.2(A1) U13.3(A2) U13.4(A3) U13.5(A4) U13.10(GND) U13.15(B4) U13.16(B3) U13.17(B2) U13.18(B1) U14.8(GND) U15.7(GND) U16.1(M) U16.2(N) U16.8(GND) U17.1(M) U17.2(N) U17.8(GND) U18.2(A1) U18.3(A2) U18.4(A3) U18.5(A4) U18.10(GND) U19.10(GND) U20.8(GND) U21.8(GND) U22.7(GND) U23.7(GND)
VCC: C1.2 R1.2 R2.2 R5.1 R6.1 R9.2 U1.4(RESET) U1.8(VCC) U2.8(VCC) U3.14(VCC) U4.14(VCC) U5.14(VCC) U6.4(RESET) U6.8(VCC) U7.1(DIR) U7.20(VCC) U8.16(VCC) U9.16(VCC) U10.1(DIR) U10.20(VCC) U11.16(VCC) U12.16(VCC) U13.20(VCC) U14.16(VCC) U15.14(VCC) U16.16(VCC) U17.16(VCC) U18.1(DIR) U18.20(VCC) U19.1(DIR) U19.20(VCC) U20.16(VCC) U21.16(VCC) U22.14(VCC) U23.14(VCC)
A0: U7.19(#OE) U10.19(#OE)
A1: U8.9(G1i) U8.10(G2i) U9.9(G1i) U9.10(G2i) U11.9(G1i) U11.10(G2i) U12.9(G1i) U12.10(G2i)
ALU_Carry_Out: U15.1(1A) U21.9(C4)
Bus1: LED47.1(A) R58.2 U7.11(B8) U9.11(4D) U10.11(B8) U12.11(4D) U13.9(A8) U14.3(A) U16.14(1D) U18.18(B1) U19.11(B8)
Bus2: LED46.1(A) R59.2 U7.12(B7) U9.12(3D) U10.12(B7) U12.12(3D) U13.8(A7) U14.4(B) U16.13(2D) U18.17(B2) U19.12(B7)
Bus3: LED45.1(A) R60.2 U7.13(B6) U9.13(2D) U10.13(B6) U12.13(2D) U13.7(A6) U14.5(C) U16.12(3D) U18.16(B3) U19.13(B6)
Bus4: LED44.1(A) R61.2 U7.14(B5) U9.14(1D) U10.14(B5) U12.14(1D) U13.6(A5) U14.6(D) U16.11(4D) U18.15(B4) U19.14(B5)
Bus5: LED43.1(A) R57.1 U7.15(B4) U8.11(4D) U10.15(B4) U11.11(4D) U17.14(1D) U18.14(B5) U19.15(B4)
Bus6: LED42.1(A) R56.1 U7.16(B3) U8.12(3D) U10.16(B3) U11.12(3D) U17.13(2D) U18.13(B6) U19.16(B3)
Bus7: LED41.1(A) R55.1 U7.17(B2) U8.13(2D) U10.17(B2) U11.13(2D) U17.12(3D) U18.12(B7) U19.17(B2)
Bus8: LED40.1(A) R54.1 U7.18(B1) U8.14(1D) U10.18(B1) U11.14(1D) U17.11(4D) U18.11(B8) U19.18(B1)
CE_Counter_Enable: U14.7(Enable P) U14.10(Enable T)
Clear: U8.15(CLR) U9.15(CLR) U11.15(CLR) U12.15(CLR)
CLK: LED3.1(A) U3.13(6A) U4.8(4Y) U8.7(CLK) U9.7(CLK) U11.7(CLK) U12.7(CLK) U14.2(Clock) U16.7(CLK) U17.7(CLK)
CLR: U14.1(Clear) U16.15(CLR) U17.15(CLR)
CounterOut: U13.19(#OE)
EO: U19.19(#OE)
HALT: U3.9(4A)
I0: U18.19(#OE)
I1: U16.9(G1i) U16.10(G2i) U17.9(G1i) U17.10(G2i)
J_Load: U15.5(2B)
JC_Load: U15.2(1B)
Log5: LED27.1(A) U16.6(4Q)
Log6: LED26.1(A) U16.5(3Q)
Log7: LED25.1(A) U16.4(2Q)
Log8: LED24.1(A) U16.3(1Q)
NOTCLK: U3.12(6Y)
REGA1: LED4.1(A) U7.9(A8) U9.6(4Q) U20.5(A1)
REGA2: LED5.1(A) U7.8(A7) U9.5(3Q) U20.3(A2)
REGA3: LED6.1(A) U7.7(A6) U9.4(2Q) U20.14(A3)
REGA4: LED7.1(A) U7.6(A5) U9.3(1Q) U20.12(A4)
REGA5: LED8.1(A) U7.5(A4) U8.6(4Q) U21.5(A1)
REGA6: LED9.1(A) U7.4(A3) U8.5(3Q) U21.3(A2)
REGA7: LED10.1(A) U7.3(A2) U8.4(2Q) U21.14(A3)
REGA8: LED11.1(A) U7.2(A1) U8.3(1Q) U21.12(A4)
REGB1: LED12.1(A) U10.9(A8) U12.6(4Q) U23.4(2A)
REGB2: LED13.1(A) U10.8(A7) U12.5(3Q) U23.1(1A)
REGB3: LED14.1(A) U10.7(A6) U12.4(2Q) U23.12(4A)
REGB4: LED15.1(A) U10.6(A5) U12.3(1Q) U23.9(3A)
REGB5: LED16.1(A) U10.5(A4) U11.6(4Q) U22.4(2A)
REGB6: LED17.1(A) U10.4(A3) U11.5(3Q) U22.1(1A)
REGB7: LED18.1(A) U10.3(A2) U11.4(2Q) U22.12(4A)
REGB8: LED19.1(A) U10.2(A1) U11.3(1Q) U22.9(3A)
SUB: U20.7(C0) U22.2(1B) U22.5(2B) U22.10(3B) U22.13(4B) U23.2(1B) U23.5(2B) U23.10(3B) U23.13(4B)
Net-(C3-2): C3.2 U6.5(CONT)
Net-(C4-2): C4.2 R2.1 U1.6(THRES) U1.7(DISCH)
Net-(C5-2): C5.2 U1.5(CONT)
Net-(C6-1): C6.1 U2.5(CONT)
Net-(C7-1): C7.1 U6.2(TRIG) U6.6(THRES) VR12.2
Net-(LED1-1): LED1.1(A) U4.2(1Y) U6.3(OUT)
Net-(LED1-2): LED1.2(K) R4.1
Net-(LED2-1): LED2.1(A) U1.3(OUT) U4.5(3A)
Net-(LED2-2): LED2.2(K) R7.2
Net-(LED3-2): LED3.2(K) R8.1
Net-(LED4-2): LED4.2(K) R10.2
Net-(LED5-2): LED5.2(K) R11.2
Net-(LED6-2): LED6.2(K) R12.2
Net-(LED7-2): LED7.2(K) R13.2
Net-(LED8-2): LED8.2(K) R14.2
Net-(LED9-2): LED9.2(K) R15.2
Net-(LED10-2): LED10.2(K) R16.2
Net-(LED11-2): LED11.2(K) R17.2
Net-(LED12-2): LED12.2(K) R18.2
Net-(LED13-2): LED13.2(K) R19.2
Net-(LED14-2): LED14.2(K) R20.2
Net-(LED15-2): LED15.2(K) R21.2
Net-(LED16-2): LED16.2(K) R22.2
Net-(LED17-2): LED17.2(K) R23.2
Net-(LED18-2): LED18.2(K) R24.2
Net-(LED19-2): LED19.2(K) R25.2
Net-(LED20-1): LED20.1(A) U13.11(B8) U14.14(QA)
Net-(LED20-2): LED20.2(K) R26.1
Net-(LED21-1): LED21.1(A) U13.12(B7) U14.13(QB)
Net-(LED21-2): LED21.2(K) R27.1
Net-(LED22-1): LED22.1(A) U13.13(B6) U14.12(QC)
Net-(LED22-2): LED22.2(K) R28.1
Net-(LED23-1): LED23.1(A) U13.14(B5) U14.11(QD)
Net-(LED23-2): LED23.2(K) R29.1
Net-(LED24-2): LED24.2(K) R30.2
Net-(LED25-2): LED25.2(K) R31.2
Net-(LED26-2): LED26.2(K) R32.2
Net-(LED27-2): LED27.2(K) R33.2
Net-(LED28-1): LED28.1(A) U17.3(1Q) U18.6(A5)
Net-(LED28-2): LED28.2(K) R34.2
Net-(LED29-1): LED29.1(A) U17.4(2Q) U18.7(A6)
Net-(LED29-2): LED29.2(K) R35.2
Net-(LED30-1): LED30.1(A) U17.5(3Q) U18.8(A7)
Net-(LED30-2): LED30.2(K) R36.2
Net-(LED31-1): LED31.1(A) U17.6(4Q) U18.9(A8)
Net-(LED31-2): LED31.2(K) R37.2
Net-(LED32-1): LED32.1(A) U19.2(A1) U21.10(S4)
Net-(LED32-2): LED32.2(K) R38.2
Net-(LED33-1): LED33.1(A) U19.3(A2) U21.13(S3)
Net-(LED33-2): LED33.2(K) R39.2
Net-(LED34-1): LED34.1(A) U19.4(A3) U21.1(S2)
Net-(LED34-2): LED34.2(K) R40.2
Net-(LED35-1): LED35.1(A) U19.5(A4) U21.4(S1)
Net-(LED35-2): LED35.2(K) R41.2
Net-(LED36-1): LED36.1(A) U19.6(A5) U20.10(S4)
Net-(LED36-2): LED36.2(K) R42.2
Net-(LED37-1): LED37.1(A) U19.7(A6) U20.13(S3)
Net-(LED37-2): LED37.2(K) R43.2
Net-(LED38-1): LED38.1(A) U19.8(A7) U20.1(S2)
Net-(LED38-2): LED38.2(K) R44.2
Net-(LED39-1): LED39.1(A) U19.9(A8) U20.4(S1)
Net-(LED39-2): LED39.2(K) R45.2
Net-(LED40-2): LED40.2(K) R46.1
Net-(LED41-2): LED41.2(K) R47.1
Net-(LED42-2): LED42.2(K) R48.1
Net-(LED43-2): LED43.2(K) R49.1
Net-(LED44-2): LED44.2(K) R50.1
Net-(LED45-2): LED45.2(K) R51.1
Net-(LED46-2): LED46.2(K) R52.1
Net-(LED47-2): LED47.2(K) R53.1
Net-(R1-1): R1.1 R3.1 U6.7(DISCH)
Net-(R3-2): R3.2 VR12.3
Net-(R5-2): R5.2 SW3.3 U1.2(TRIG)
Net-(R6-2): R6.2 SW1.3 U2.4(RESET)
Net-(R9-1): R9.1 SW1.1 U2.2(TRIG)
Net-(U2-3): U2.3(OUT) U3.1(1A) U4.1(1A)
Net-(U3-2): U3.2(1Y) U4.4(2Y)
Net-(U3-8): U3.8(4Y) U4.10(5Y)
Net-(U4-3): U4.3(2A) U5.1(1A)
Net-(U4-6): U4.6(3Y) U5.2(1Y)
Net-(U4-9): U4.9(4A) U5.3(2A)
Net-(U14-9): U14.9(Load) U15.8(3Y)
Net-(U15-3): U15.3(1Y) U15.4(2A)
Net-(U15-6): U15.6(2Y) U15.9(3B) U15.10(3A)
Net-(U20-2): U20.2(B2) U23.3(1Y)
Net-(U20-6): U20.6(B1) U23.6(2Y)
Net-(U20-9): U20.9(C4) U21.7(C0)
Net-(U20-11): U20.11(B4) U23.8(3Y)
Net-(U20-15): U20.15(B3) U23.11(4Y)
Net-(U21-2): U21.2(B2) U22.3(1Y)
Net-(U21-6): U21.6(B1) U22.6(2Y)
Net-(U21-11): U21.11(B4) U22.8(3Y)
Net-(U21-15): U21.15(B3) U22.11(4Y)

Not connected (* = marked no-connect by the designer): SW1 4* 5* 6*; SW3 2* 4*; U2 7(DISCH)*; U3 3(2A)* 4(2Y)* 5(3A)* 6(3Y)* 10(5Y)* 11(5A)*; U4 11(5A)* 12(6Y)* 13(6A)*; U5 4(2Y)* 5(3A)* 6(3Y)* 8(4Y)* 9(4A)* 10(5Y)* 11(5A)* 12(6Y)* 13(6A)*; U14 15(Ripple Carry Output)*; U15 11(4Y)* 12(4B)* 13(4A)*; VR12 1*

## Notes on the sheets
sheet 1
- Clock Generator
sheet 2
- Jump
sheet 3
- 8
- 7
- 6
- 5
- 4
- 3
- 2
- 1
sheet 4
- 8
- 7
- 6
- 5
- 4
- 3
- 2
- 1
